# Altium project Main.PrjPcb
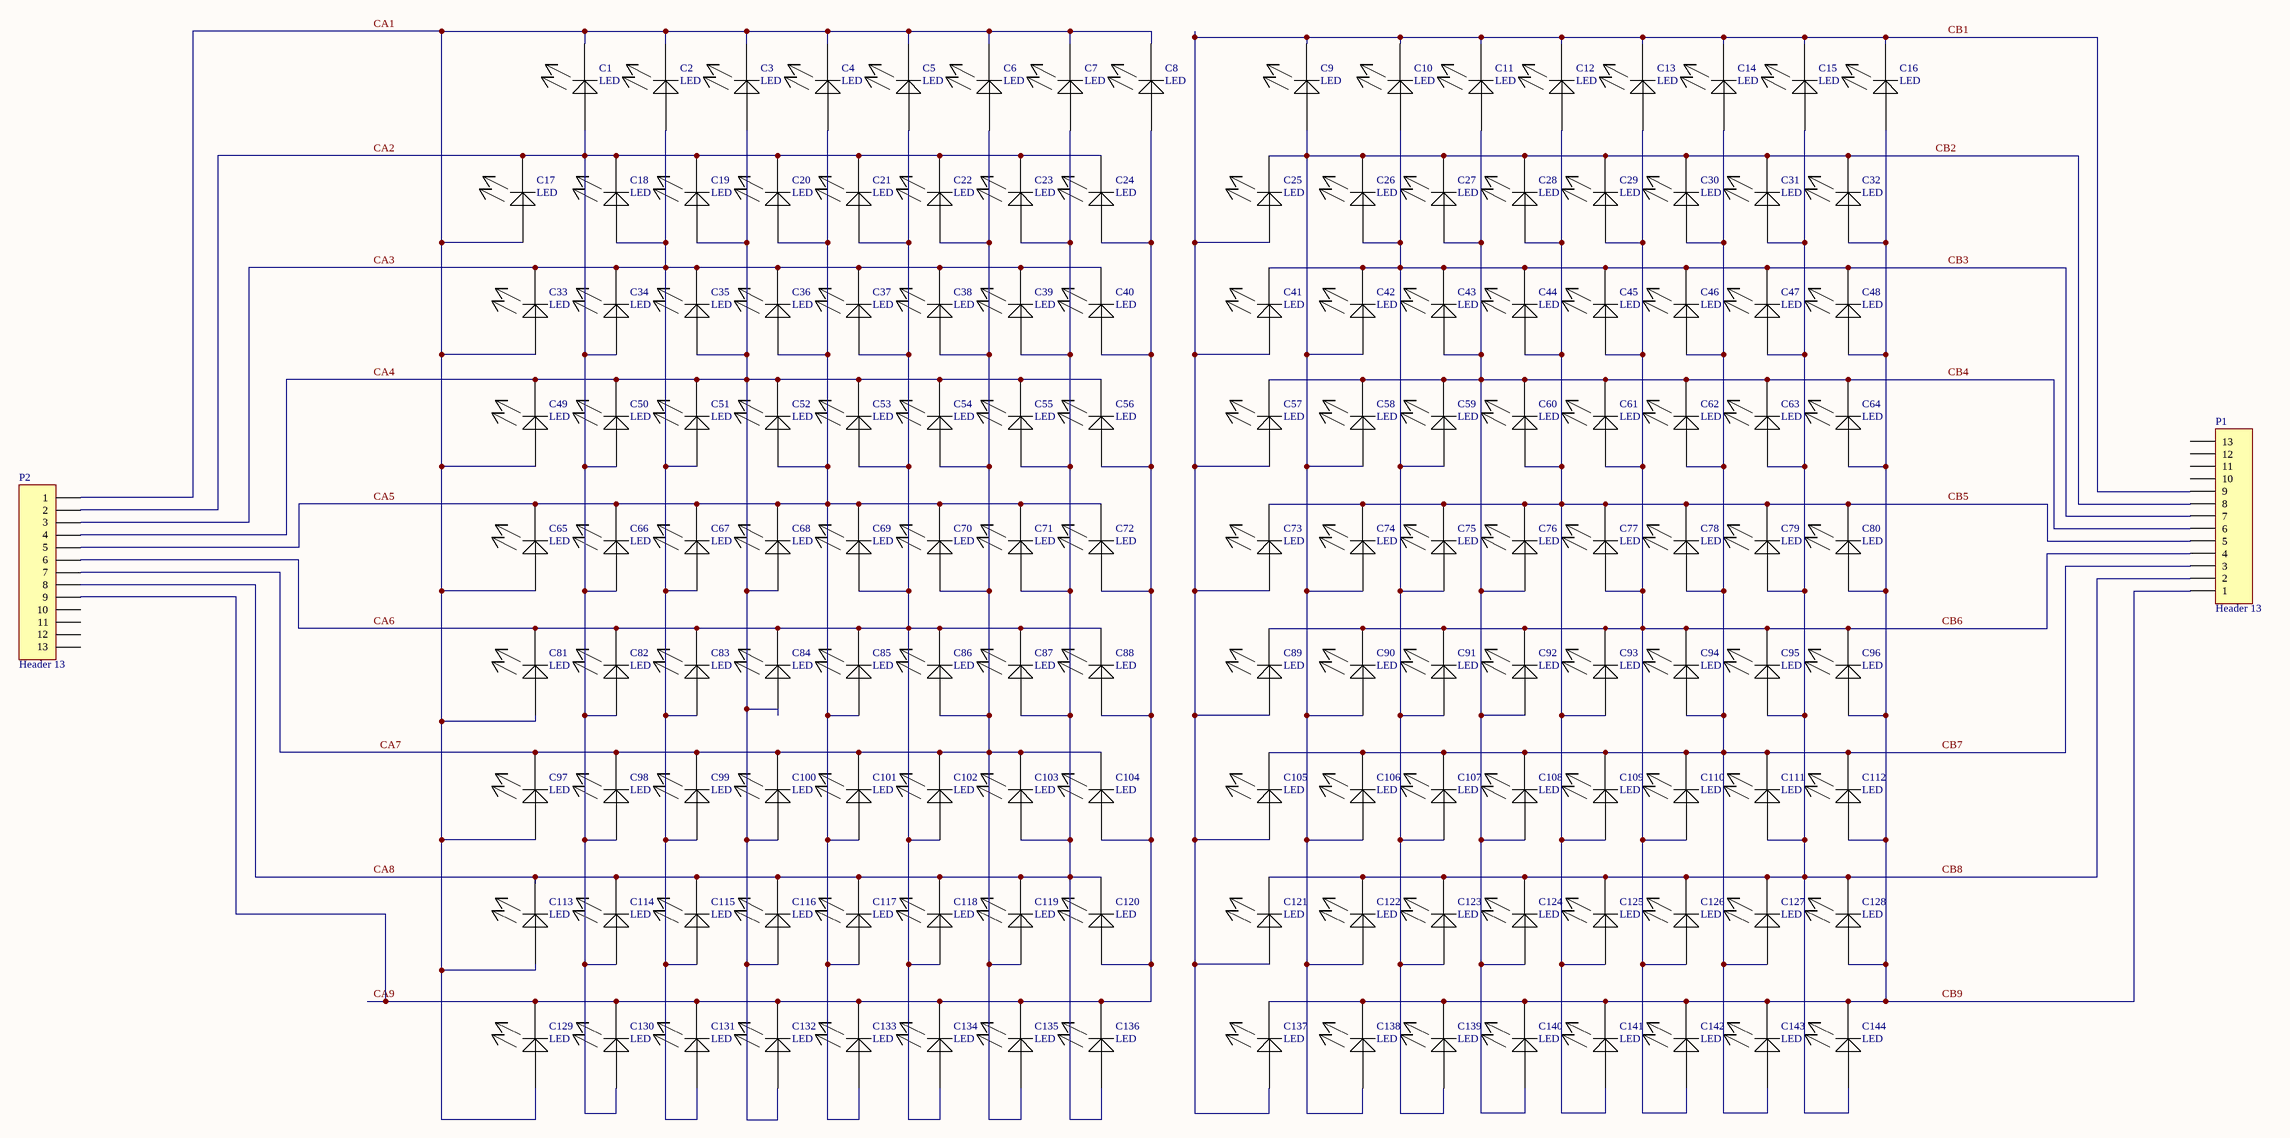
[diagram p0: Sheet1.SchDoc]
4 sheets, 601 parts. Net scope: flat (ports and power ports of the same name join across sheets).
Sheets:
  Sheet1.SchDoc
  Sheet2.SchDoc
  Sheet3.SchDoc
  Sheet4_Matrix.SchDoc

## Sheet Sheet1.SchDoc
size A1

### Parts
(Parts that share a designator on the sheet are numbered #1, #2 ... from top to bottom, then left to right.)
C1#1  LED  [LED 0603(2)]
C2#1  LED  [LED 0603(2)]
C3#1  LED  [LED 0603(2)]
C4#1  LED  [LED 0603(2)]
C5#1  LED  [LED 0603(2)]
C6#1  LED  [LED 0603(2)]
C7#1  LED  [LED 0603(2)]
C8#1  LED  [LED 0603(2)]
C9#1  LED  [LED 0603(2)]
C10#1  LED  [LED 0603(2)]
C11#1  LED  [LED 0603(2)]
C12#1  LED  [LED 0603(2)]
C13#1  LED  [LED 0603(2)]
C14#1  LED  [LED 0603(2)]
C15#1  LED  [LED 0603(2)]
C16#1  LED  [LED 0603(2)]
C17#1  LED  [LED 0603(2)]
C18#1  LED  [LED 0603(2)]
C19  LED  [LED 0603(2)]
C20  LED  [LED 0603(2)]
C21  LED  [LED 0603(2)]
C22  LED  [LED 0603(2)]
C23  LED  [LED 0603(2)]
C24  LED  [LED 0603(2)]
C25  LED  [LED 0603(2)]
C26  LED  [LED 0603(2)]
C27  LED  [LED 0603(2)]
C28  LED  [LED 0603(2)]
C29  LED  [LED 0603(2)]
C30  LED  [LED 0603(2)]
C31  LED  [LED 0603(2)]
C32  LED  [LED 0603(2)]
C33  LED  [LED 0603(2)]
C34  LED  [LED 0603(2)]
C35  LED  [LED 0603(2)]
C36  LED  [LED 0603(2)]
C37  LED  [LED 0603(2)]
C38  LED  [LED 0603(2)]
C39  LED  [LED 0603(2)]
C40  LED  [LED 0603(2)]
C41  LED  [LED 0603(2)]
C42  LED  [LED 0603(2)]
C43  LED  [LED 0603(2)]
C44  LED  [LED 0603(2)]
C45  LED  [LED 0603(2)]
C46  LED  [LED 0603(2)]
C47  LED  [LED 0603(2)]
C48  LED  [LED 0603(2)]
C49  LED  [LED 0603(2)]
C50  LED  [LED 0603(2)]
C51  LED  [LED 0603(2)]
C52  LED  [LED 0603(2)]
C53  LED  [LED 0603(2)]
C54  LED  [LED 0603(2)]
C55  LED  [LED 0603(2)]
C56  LED  [LED 0603(2)]
C57  LED  [LED 0603(2)]
C58  LED  [LED 0603(2)]
C59  LED  [LED 0603(2)]
C60  LED  [LED 0603(2)]
C61  LED  [LED 0603(2)]
C62  LED  [LED 0603(2)]
C63  LED  [LED 0603(2)]
C64  LED  [LED 0603(2)]
C65  LED  [LED 0603(2)]
C66  LED  [LED 0603(2)]
C67  LED  [LED 0603(2)]
C68  LED  [LED 0603(2)]
C69  LED  [LED 0603(2)]
C70  LED  [LED 0603(2)]
C71  LED  [LED 0603(2)]
C72  LED  [LED 0603(2)]
C73  LED  [LED 0603(2)]
C74  LED  [LED 0603(2)]
C75  LED  [LED 0603(2)]
C76  LED  [LED 0603(2)]
C77  LED  [LED 0603(2)]
C78  LED  [LED 0603(2)]
C79  LED  [LED 0603(2)]
C80  LED  [LED 0603(2)]
C81  LED  [LED 0603(2)]
C82  LED  [LED 0603(2)]
C83  LED  [LED 0603(2)]
C84  LED  [LED 0603(2)]
C85  LED  [LED 0603(2)]
C86  LED  [LED 0603(2)]
C87  LED  [LED 0603(2)]
C88  LED  [LED 0603(2)]
C89  LED  [LED 0603(2)]
C90  LED  [LED 0603(2)]
C91  LED  [LED 0603(2)]
C92  LED  [LED 0603(2)]
C93  LED  [LED 0603(2)]
C94  LED  [LED 0603(2)]
C95  LED  [LED 0603(2)]
C96  LED  [LED 0603(2)]
C97  LED  [LED 0603(2)]
C98  LED  [LED 0603(2)]
C99  LED  [LED 0603(2)]
C100  LED  [LED 0603(2)]
C101  LED  [LED 0603(2)]
C102  LED  [LED 0603(2)]
C103  LED  [LED 0603(2)]
C104  LED  [LED 0603(2)]
C105  LED  [LED 0603(2)]
C106  LED  [LED 0603(2)]
C107  LED  [LED 0603(2)]
C108  LED  [LED 0603(2)]
C109  LED  [LED 0603(2)]
C110  LED  [LED 0603(2)]
C111  LED  [LED 0603(2)]
C112  LED  [LED 0603(2)]
C113  LED  [LED 0603(2)]
C114  LED  [LED 0603(2)]
C115  LED  [LED 0603(2)]
C116  LED  [LED 0603(2)]
C117  LED  [LED 0603(2)]
C118  LED  [LED 0603(2)]
C119  LED  [LED 0603(2)]
C120  LED  [LED 0603(2)]
C121  LED  [LED 0603(2)]
C122  LED  [LED 0603(2)]
C123  LED  [LED 0603(2)]
C124  LED  [LED 0603(2)]
C125  LED  [LED 0603(2)]
C126  LED  [LED 0603(2)]
C127  LED  [LED 0603(2)]
C128  LED  [LED 0603(2)]
C129  LED  [LED 0603(2)]
C130  LED  [LED 0603(2)]
C131  LED  [LED 0603(2)]
C132  LED  [LED 0603(2)]
C133  LED  [LED 0603(2)]
C134  LED  [LED 0603(2)]
C135  LED  [LED 0603(2)]
C136  LED  [LED 0603(2)]
C137  LED  [LED 0603(2)]
C138  LED  [LED 0603(2)]
C139  LED  [LED 0603(2)]
C140  LED  [LED 0603(2)]
C141  LED  [LED 0603(2)]
C142  LED  [LED 0603(2)]
C143  LED  [LED 0603(2)]
C144  LED  [LED 0603(2)]
P1#1  Header 13  [HDR1X13]
P2#1  Header 13  [HDR1X13]

### Nets
CA1: C1#1.2(-) C2#1.2(-) C3#1.2(-) C4#1.2(-) C5#1.2(-) C6#1.2(-) C7#1.2(-) C8#1.2(-) C17#1.1(+) C33.1(+) C49.1(+) C65.1(+) C81.1(+) C97.1(+) C113.1(+) C129.1(+) P2#1.1
CA2: C1#1.1(+) C17#1.2(-) C18#1.2(-) C19.2(-) C20.2(-) C21.2(-) C22.2(-) C23.2(-) C24.2(-) C34.1(+) C50.1(+) C66.1(+) C82.1(+) C98.1(+) C114.1(+) C130.1(+) P2#1.2
CA3: C2#1.1(+) C18#1.1(+) C33.2(-) C34.2(-) C35.2(-) C36.2(-) C37.2(-) C38.2(-) C39.2(-) C40.2(-) C51.1(+) C67.1(+) C83.1(+) C99.1(+) C115.1(+) C131.1(+) P2#1.3
CA4: C3#1.1(+) C19.1(+) C35.1(+) C49.2(-) C50.2(-) C51.2(-) C52.2(-) C53.2(-) C54.2(-) C55.2(-) C56.2(-) C68.1(+) C84.1(+) C100.1(+) C116.1(+) C132.1(+) P2#1.4
CA5: C4#1.1(+) C20.1(+) C36.1(+) C52.1(+) C65.2(-) C66.2(-) C67.2(-) C68.2(-) C69.2(-) C70.2(-) C71.2(-) C72.2(-) C85.1(+) C101.1(+) C117.1(+) C133.1(+) P2#1.5
CA6: C5#1.1(+) C21.1(+) C37.1(+) C53.1(+) C69.1(+) C81.2(-) C82.2(-) C83.2(-) C84.2(-) C85.2(-) C86.2(-) C87.2(-) C88.2(-) C102.1(+) C118.1(+) C134.1(+) P2#1.6
CA7: C6#1.1(+) C22.1(+) C38.1(+) C54.1(+) C70.1(+) C86.1(+) C97.2(-) C98.2(-) C99.2(-) C100.2(-) C101.2(-) C102.2(-) C103.2(-) C104.2(-) C119.1(+) C135.1(+) P2#1.7
CA8: C7#1.1(+) C23.1(+) C39.1(+) C55.1(+) C71.1(+) C87.1(+) C103.1(+) C113.2(-) C114.2(-) C115.2(-) C116.2(-) C117.2(-) C118.2(-) C119.2(-) C120.2(-) C136.1(+) P2#1.8
CA9: C8#1.1(+) C24.1(+) C40.1(+) C56.1(+) C72.1(+) C88.1(+) C104.1(+) C120.1(+) C129.2(-) C130.2(-) C131.2(-) C132.2(-) C133.2(-) C134.2(-) C135.2(-) C136.2(-) P2#1.9
CB1: C9#1.2(-) C10#1.2(-) C11#1.2(-) C12#1.2(-) C13#1.2(-) C14#1.2(-) C15#1.2(-) C16#1.2(-) C25.1(+) C41.1(+) C57.1(+) C73.1(+) C89.1(+) C105.1(+) C121.1(+) C137.1(+) P1#1.9
CB2: C9#1.1(+) C25.2(-) C26.2(-) C27.2(-) C28.2(-) C29.2(-) C30.2(-) C31.2(-) C32.2(-) C42.1(+) C58.1(+) C74.1(+) C90.1(+) C106.1(+) C122.1(+) C138.1(+) P1#1.8
CB3: C10#1.1(+) C26.1(+) C41.2(-) C42.2(-) C43.2(-) C44.2(-) C45.2(-) C46.2(-) C47.2(-) C48.2(-) C59.1(+) C75.1(+) C91.1(+) C107.1(+) C123.1(+) C139.1(+) P1#1.7
CB4: C11#1.1(+) C27.1(+) C43.1(+) C57.2(-) C58.2(-) C59.2(-) C60.2(-) C61.2(-) C62.2(-) C63.2(-) C64.2(-) C76.1(+) C92.1(+) C108.1(+) C124.1(+) C140.1(+) P1#1.6
CB5: C12#1.1(+) C28.1(+) C44.1(+) C60.1(+) C73.2(-) C74.2(-) C75.2(-) C76.2(-) C77.2(-) C78.2(-) C79.2(-) C80.2(-) C93.1(+) C109.1(+) C125.1(+) C141.1(+) P1#1.5
CB6: C13#1.1(+) C29.1(+) C45.1(+) C61.1(+) C77.1(+) C89.2(-) C90.2(-) C91.2(-) C92.2(-) C93.2(-) C94.2(-) C95.2(-) C96.2(-) C110.1(+) C126.1(+) C142.1(+) P1#1.4
CB7: C14#1.1(+) C30.1(+) C46.1(+) C62.1(+) C78.1(+) C94.1(+) C105.2(-) C106.2(-) C107.2(-) C108.2(-) C109.2(-) C110.2(-) C111.2(-) C112.2(-) C127.1(+) C143.1(+) P1#1.3
CB8: C15#1.1(+) C31.1(+) C47.1(+) C63.1(+) C79.1(+) C95.1(+) C111.1(+) C121.2(-) C122.2(-) C123.2(-) C124.2(-) C125.2(-) C126.2(-) C127.2(-) C128.2(-) C144.1(+) P1#1.2
CB9: C16#1.1(+) C32.1(+) C48.1(+) C64.1(+) C80.1(+) C96.1(+) C112.1(+) C128.1(+) C137.2(-) C138.2(-) C139.2(-) C140.2(-) C141.2(-) C142.2(-) C143.2(-) C144.2(-) P1#1.1

Not connected (* = marked no-connect by the designer): P1#1 10 11 12 13; P2#1 10 11 12 13

### Library data of the parts
P1#1 P2#1 = Header 13: Header, 13-Pin; LatestRevisionDate: 17-Jul-2002; LatestRevisionNote: Re-released for DXP Platform.; Publisher: Altium Limited

## Sheet Sheet2.SchDoc
size A3
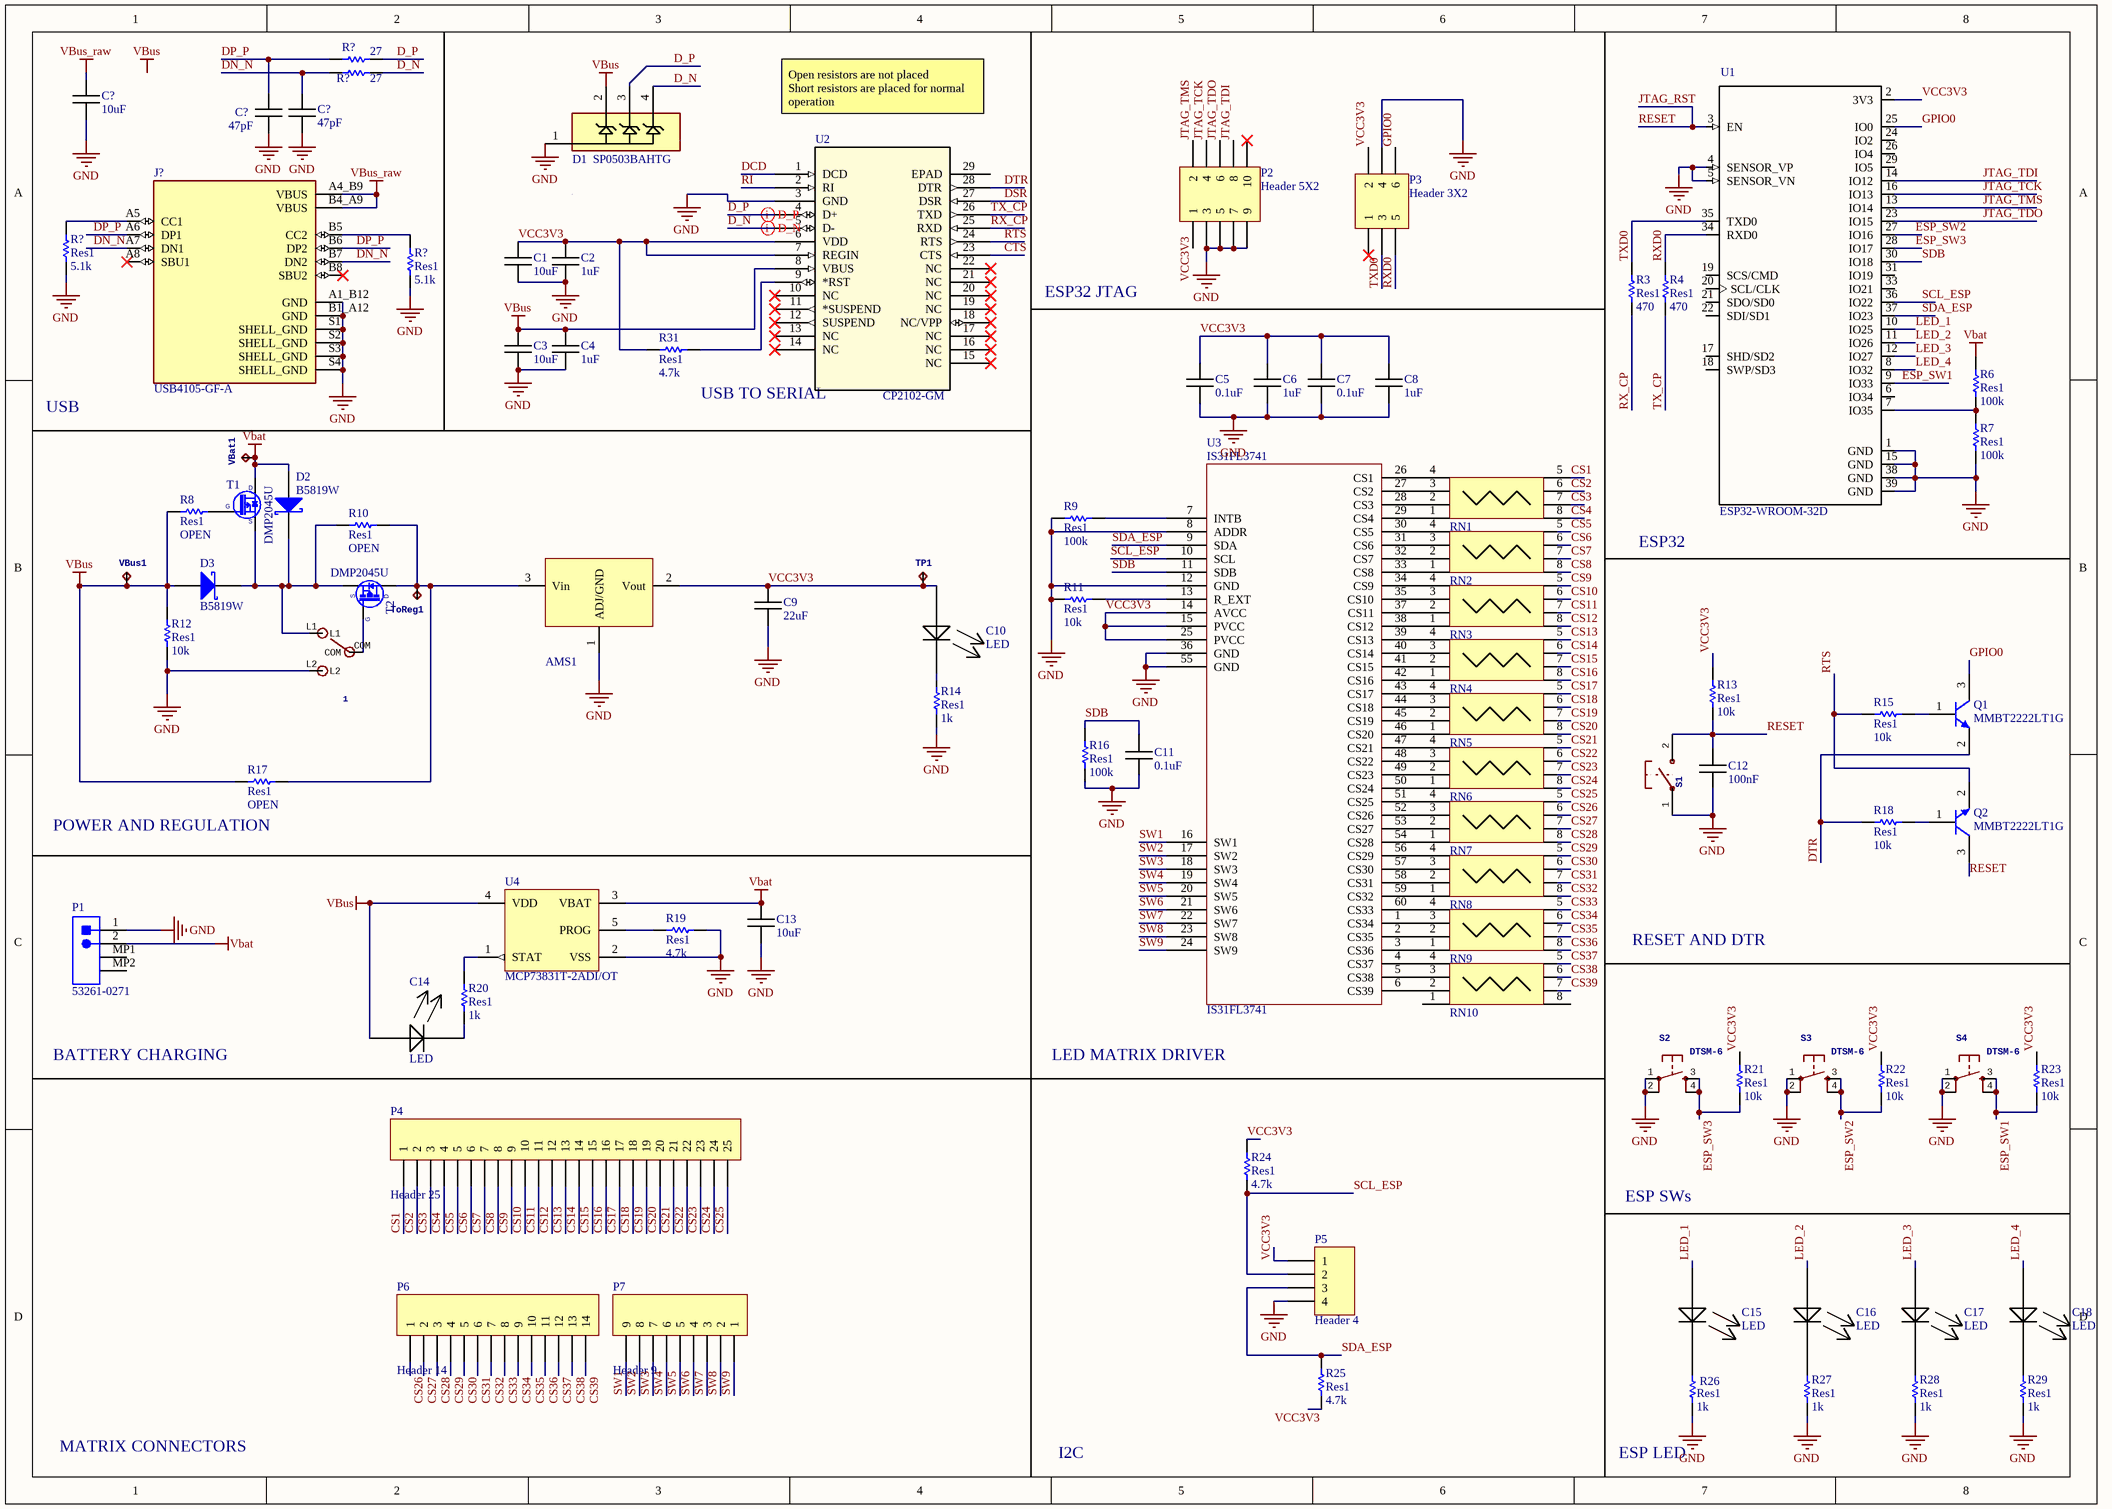
[diagram p1: Sheet2.SchDoc]

### Parts
(Parts that share a designator on the sheet are numbered #1, #2 ... from top to bottom, then left to right.)
1  Footprint of the VIMEX MSK-12C02 SPDT SMD Switch Created by mzst on 17-Jan-2016  [MSK-12C02]  (value not drawn)
AMS1  AMS1117  [SOT-223-3]  (value not drawn)
C1#2  10uF  [C 0603 / 1608]
C2#2  1uF  [C 0603 / 1608]
C3#2  10uF  [C 0603 / 1608]
C4#2  1uF  [C 0603 / 1608]
C5#2  0.1uF  [C 0603 / 1608]
C6#2  1uF  [C 0603 / 1608]
C7#2  0.1uF  [C 0603 / 1608]
C8#2  1uF  [C 0603 / 1608]
C9#2  22uF  [C 0603 / 1608]
C10#2  LED  [LED 0603(2)]
C11#2  0.1uF  [C 0603 / 1608]
C12#2  100nF  [C 0603 / 1608]
C13#2  10uF  [C 0603 / 1608]
C14#2  LED  [LED 0603(2)]
C15#2  LED  [LED 0603(2)]
C16#2  LED  [LED 0603(2)]
C17#2  LED  [LED 0603(2)]
C18#2  LED  [LED 0603(2)]
C?#1  10uF  [C 0603 / 1608]
C?#2  47pF  [C 0603 / 1608]
C?#3  47pF  [C 0603 / 1608]
D1  Part Number: SP0503BAHTG  [Littelfuse_SP0503BAHTG_0]  (hidden comment: Diode_Littelfuse_SP0503BAHTG_eec)
D2  B5819W  [MCC-SOD123_V]
D3  B5819W  [MCC-SOD123_V]
J?  USB4105-GF-A  [GCT_USB4105-GF-A]
P1#2  53261-0271  [MOLX-53261-0271_V]
P2#2  Header 5X2  [5x2_SidePCB]
P3  Header 3X2  [3x2_SidePCB]
P4  Header 25  [HDR1X25]
P5  Header 4  [HDR1X4]
P6  Header 14  [HDR1X14]
P7  Header 9  [HDR1X9]
Q1  MMBT2222LT1G  [ONSC-SOT-23-3-318-08_M]
Q2  MMBT2222LT1G  [ONSC-SOT-23-3-318-08_M]
R3  Res1  value 470  [C 0603 / 1608]
R4  Res1  value 470  [C 0603 / 1608]
R6  Res1  value 100k  [C 0603 / 1608]
R7  Res1  value 100k  [C 0603 / 1608]
R8  Res1  value OPEN  [C 0603 / 1608]
R9  Res1  value 100k  [C 0603 / 1608]
R10  Res1  value OPEN  [C 0603 / 1608]
R11  Res1  value 10k  [C 0603 / 1608]
R12#1  Res1  value 10k  [C 0603 / 1608]
R13  Res1  value 10k  [C 0603 / 1608]
R14  Res1  value 1k  [C 0603 / 1608]
R15  Res1  value 10k  [C 0603 / 1608]
R16  Res1  value 100k  [C 0603 / 1608]
R17  Res1  value OPEN  [C 0603 / 1608]
R18  Res1  value 10k  [C 0603 / 1608]
R19  Res1  value 4.7k  [C 0603 / 1608]
R20  Res1  value 1k  [C 0603 / 1608]
R21  Res1  value 10k  [C 0603 / 1608]
R22  Res1  value 10k  [C 0603 / 1608]
R23  Res1  value 10k  [C 0603 / 1608]
R24  Res1  value 4.7k  [C 0603 / 1608]
R25  Res1  value 4.7k  [C 0603 / 1608]
R26  Res1  value 1k  [C 0603 / 1608]
R27  Res1  value 1k  [C 0603 / 1608]
R28  Res1  value 1k  [C 0603 / 1608]
R29  Res1  value 1k  [C 0603 / 1608]
R31  Res1  value 4.7k  [C 0603 / 1608]
R?#1  value 27  [C 0603 / 1608]  (hidden comment: Res1)
R?#2  value 27  [C 0603 / 1608]  (hidden comment: Res1)
R?#3  Res1  value 5.1k  [C 0603 / 1608]
R?#4  Res1  value 5.1k  [C 0603 / 1608]
RN1  742C083121JP  [RESARRAY(4x0603)]  (value not drawn)
RN2  742C083121JP  [RESARRAY(4x0603)]  (value not drawn)
RN3  742C083121JP  [RESARRAY(4x0603)]  (value not drawn)
RN4  742C083121JP  [RESARRAY(4x0603)]  (value not drawn)
RN5  742C083121JP  [RESARRAY(4x0603)]  (value not drawn)
RN6  742C083121JP  [RESARRAY(4x0603)]  (value not drawn)
RN7  742C083121JP  [RESARRAY(4x0603)]  (value not drawn)
RN8  742C083121JP  [RESARRAY(4x0603)]  (value not drawn)
RN9  742C083121JP  [RESARRAY(4x0603)]  (value not drawn)
RN10  742C083121JP  [RESARRAY(4x0603)]  (value not drawn)
S1  Switch  [PUSH_SMD_3x4]  (value not drawn)
S2  DTSM-6  [DTSM-6]
S3  DTSM-6  [DTSM-6]
S4  DTSM-6  [DTSM-6]
T1  DMP2045U  [SOT95P237X112-3N]
T2  DMP2045U  [SOT95P237X112-3N]
ToReg1  Test pad  [TP20R]  (value not drawn)
TP1  Test pad  [TP20R]  (value not drawn)
U1  ESP32-WROOM-32D  [MODULE_ESP32-WROOM-32D]
U2  CP2102-GM  [QFN28_5X5]
U3#1  IS31FL3741  [QFN40P700X700X80-61N]
U4  MCP73831T-2ADI/OT  [SOT-23-OT5_M]
VBat1  Test pad  [TP20R]  (value not drawn)
VBus1  Test pad  [TP20R]  (value not drawn)

### Nets
GND: 1.L2 AMS1.1(ADJ/GND) C1#2.1 C2#2.1 C3#2.1 C4#2.1 C5#2.1 C6#2.1 C7#2.1 C8#2.1 C9#2.1 C11#2.2 C12#2.2 C13#2.1 C?#1.1 C?#2.1 C?#3.1 D1.1(COMMON_ANODE) J?.A1_B12(GND) J?.B1_A12(GND) J?.S1(SHELL_GND) J?.S2(SHELL_GND) J?.S3(SHELL_GND) J?.S4(SHELL_GND) P1#2.1 P2#2.3 P2#2.5 P2#2.7 P2#2.9 P3.4 P5.4 R7.1 R9.1 R11.1 R12#1.2 R14.2 R16.1 R19.1 R26.2 R27.2 R28.2 R29.2 R?#3.1 R?#4.1 S1.1(P$1) S2.1 S2.2 S3.1 S3.2 S4.1 S4.2 U1.1(GND) U1.4(SENSOR_VP) U1.5(SENSOR_VN) U1.15(GND) U1.38(GND) U1.39(GND) U2.3(GND) U3#1.8(ADDR) U3#1.12(GND) U3#1.36(GND) U3#1.55(GND) U4.2(VSS)
Vbat: C13#2.2 D2.1(A) P1#2.2 R6.2 T1.3(D) U4.3(VBAT) VBat1.TP
VBus: C3#2.2 C4#2.2 C14#2.1(+) D1.2(1_CATHODE) D3.1(A) R8.1 R12#1.1 R17.1 U2.8(VBUS) U4.4(VDD) VBus1.TP
VBus_raw: C?#1.2 J?.A4_B9(VBUS) J?.B4_A9(VBUS)
CS1: P4.1 RN1.5
CS2: P4.2 RN1.6
CS3: P4.3 RN1.7
CS4: P4.4 RN1.8
CS5: P4.5 RN2.5
CS6: P4.6 RN2.6
CS7: P4.7 RN2.7
CS8: P4.8 RN2.8
CS9: P4.9 RN3.5
CS10: P4.10 RN3.6
CS11: P4.11 RN3.7
CS12: P4.12 RN3.8
CS13: P4.13 RN4.5
CS14: P4.14 RN4.6
CS15: P4.15 RN4.7
CS16: P4.16 RN4.8
CS17: P4.17 RN5.5
CS18: P4.18 RN5.6
CS19: P4.19 RN5.7
CS20: P4.20 RN5.8
CS21: P4.21 RN6.5
CS22: P4.22 RN6.6
CS23: P4.23 RN6.7
CS24: P4.24 RN6.8
CS25: P4.25 RN7.5
CS26: P6.1 RN7.6
CS27: P6.2 RN7.7
CS28: P6.3 RN7.8
CS29: P6.4 RN8.5
CS30: P6.5 RN8.6
CS31: P6.6 RN8.7
CS32: P6.7 RN8.8
CS33: P6.8 RN9.5
CS34: P6.9 RN9.6
CS35: P6.10 RN9.7
CS36: P6.11 RN9.8
CS37: P6.12 RN10.5
CS38: P6.13 RN10.6
CS39: P6.14 RN10.7
CTS: U2.23(CTS)
D_N: D1.4(3_CATHODE) R?#2.1 U2.5(D-)
D_P: D1.3(2_CATHODE) R?#1.1 U2.4(D+)
DCD: U2.1(DCD)
DN_N: C?#3.2 J?.A7(DN1) J?.B7(DN2) R?#2.2
DP_P: C?#2.2 J?.A6(DP1) J?.B6(DP2) R?#1.2
DSR: U2.27(DSR)
DTR: Q1.2(E) R18.1 U2.28(DTR)
ESP_SW1: R23.1 S4.3 S4.4 U1.9(IO33)
ESP_SW2: R22.1 S3.3 S3.4 U1.27(IO16)
ESP_SW3: R21.1 S2.3 S2.4 U1.28(IO17)
GPIO0: P3.6 Q1.3(C) U1.25(IO0)
JTAG_RST: C12#2.1 Q2.3(C) R13.2 S1.2(P$2) U1.3(EN)  [also labelled RESET]
JTAG_TCK: P2#2.4 U1.16(IO13)
JTAG_TDI: P2#2.8 U1.14(IO12)
JTAG_TDO: P2#2.6 U1.23(IO15)
JTAG_TMS: P2#2.2 U1.13(IO14)
LED_1: C15#2.1(+) U1.10(IO25)
LED_2: C16#2.1(+) U1.11(IO26)
LED_3: C17#2.1(+) U1.12(IO27)
LED_4: C18#2.1(+) U1.8(IO32)
RI: U2.2(RI)
RTS: Q2.2(E) R15.1 U2.24(RTS)
RX_CP: R3.1 U2.25(RXD)
RXD0: P3.5 R4.2 U1.34(RXD0)
SCL_ESP: P5.2 R24.2 U1.36(IO22) U3#1.10(SCL)
SDA_ESP: P5.3 R25.2 U1.37(IO23) U3#1.9(SDA)
SDB: C11#2.1 R16.2 U1.30(IO18) U3#1.11(SDB)
SW1: P7.9 U3#1.16(SW1)
SW2: P7.8 U3#1.17(SW2)
SW3: P7.7 U3#1.18(SW3)
SW4: P7.6 U3#1.19(SW4)
SW5: P7.5 U3#1.20(SW5)
SW6: P7.4 U3#1.21(SW6)
SW7: P7.3 U3#1.22(SW7)
SW8: P7.2 U3#1.23(SW8)
SW9: P7.1 U3#1.24(SW9)
TX_CP: R4.1 U2.26(TXD)
TXD0: P3.3 R3.2 U1.35(TXD0)
VCC3V3: AMS1.2(Vout) C1#2.2 C2#2.2 C5#2.2 C6#2.2 C7#2.2 C8#2.2 C9#2.2 C10#2.1(+) P3.2 P5.1 R13.1 R21.2 R22.2 R23.2 R24.1 R25.1 R31.1 TP1.TP U1.2(3V3) U2.6(VDD) U2.7(REGIN) U3#1.14(AVCC) U3#1.15(PVCC) U3#1.25(PVCC)
Net1_COM: 1.COM T2.1(G)
Net1_L1: 1.L1 D2.2(K) D3.2(K) R10.1 T1.2(S) T2.2(S)
NetAMS1_3: AMS1.3(Vin) R10.2 R17.2 T2.3(D) ToReg1.TP
NetC10#2_2: C10#2.2(-) R14.1
NetC14#2_2: C14#2.2(-) R20.2
NetC15#2_2: C15#2.2(-) R26.1
NetC16#2_2: C16#2.2(-) R27.1
NetC17#2_2: C17#2.2(-) R28.1
NetC18#2_2: C18#2.2(-) R29.1
NetJ?_A5: J?.A5(CC1) R?#3.2
NetJ?_B5: J?.B5(CC2) R?#4.2
NetQ1_1: Q1.1(B) R15.2
NetQ2_1: Q2.1(B) R18.2
NetR6_1: R6.1 R7.2 U1.7(IO35)
NetR8_2: R8.2 T1.1(G)
NetR9_2: R9.2 U3#1.7(INTB)
NetR11_2: R11.2 U3#1.13(R_EXT)
NetR19_2: R19.2 U4.5(PROG)
NetR20_1: R20.1 U4.1(STAT)
NetR31_2: R31.2 U2.9(*RST)
NetRN1_1: RN1.1 U3#1.29(CS4)
NetRN1_2: RN1.2 U3#1.28(CS3)
NetRN1_3: RN1.3 U3#1.27(CS2)
NetRN1_4: RN1.4 U3#1.26(CS1)
NetRN2_1: RN2.1 U3#1.33(CS8)
NetRN2_2: RN2.2 U3#1.32(CS7)
NetRN2_3: RN2.3 U3#1.31(CS6)
NetRN2_4: RN2.4 U3#1.30(CS5)
NetRN3_1: RN3.1 U3#1.38(CS12)
NetRN3_2: RN3.2 U3#1.37(CS11)
NetRN3_3: RN3.3 U3#1.35(CS10)
NetRN3_4: RN3.4 U3#1.34(CS9)
NetRN4_1: RN4.1 U3#1.42(CS16)
NetRN4_2: RN4.2 U3#1.41(CS15)
NetRN4_3: RN4.3 U3#1.40(CS14)
NetRN4_4: RN4.4 U3#1.39(CS13)
NetRN5_1: RN5.1 U3#1.46(CS20)
NetRN5_2: RN5.2 U3#1.45(CS19)
NetRN5_3: RN5.3 U3#1.44(CS18)
NetRN5_4: RN5.4 U3#1.43(CS17)
NetRN6_1: RN6.1 U3#1.50(CS24)
NetRN6_2: RN6.2 U3#1.49(CS23)
NetRN6_3: RN6.3 U3#1.48(CS22)
NetRN6_4: RN6.4 U3#1.47(CS21)
NetRN7_1: RN7.1 U3#1.54(CS28)
NetRN7_2: RN7.2 U3#1.53(CS27)
NetRN7_3: RN7.3 U3#1.52(CS26)
NetRN7_4: RN7.4 U3#1.51(CS25)
NetRN8_1: RN8.1 U3#1.59(CS32)
NetRN8_2: RN8.2 U3#1.58(CS31)
NetRN8_3: RN8.3 U3#1.57(CS30)
NetRN8_4: RN8.4 U3#1.56(CS29)
NetRN9_1: RN9.1 U3#1.3(CS36)
NetRN9_2: RN9.2 U3#1.2(CS35)
NetRN9_3: RN9.3 U3#1.1(CS34)
NetRN9_4: RN9.4 U3#1.60(CS33)
NetRN10_2: RN10.2 U3#1.6(CS39)
NetRN10_3: RN10.3 U3#1.5(CS38)
NetRN10_4: RN10.4 U3#1.4(CS37)

Not connected (* = marked no-connect by the designer): J? A8(SBU1)* B8(SBU2)*; P1#2 MP1 MP2; P2#2 1 10*; P3 1*; RN10 1 8; U1 6(IO34) 17(SHD/SD2) 18(SWP/SD3) 19(SCS/CMD) 20(SCL/CLK) 21(SDO/SD0) 22(SDI/SD1) 24(IO2) 26(IO4) 29(IO5) 31(IO19) 33(IO21); U2 10(NC)* 11(*SUSPEND)* 12(SUSPEND)* 13(NC)* 14(NC)* 15(NC)* 16(NC)* 17(NC)* 18(NC/VPP)* 19(NC)* 20(NC)* 21(NC)* 22(NC)* 29(EPAD)

### Layout directives
differential pair: D_N, D_P

### Notes on the sheet
- Open resistors are not placed
  Short resistors are placed for normal operation
- ESP32 JTAG
- USB
- (near U2) USB TO SERIAL
- ESP32
- (near R17) POWER AND REGULATION
- RESET AND DTR
- BATTERY CHARGING
- LED MATRIX DRIVER
- ESP SWs
- MATRIX CONNECTORS
- I2C
- (near R26) ESP LED
- Labels drawn without touching a wire or pin: VBus, VCC3V3

### Library data of the parts
1 = MSK-12C02_SMD_SPDT_SWITCH
AMS1 = AMS1117: LDO 3.3V/5V/12V
C1#2 C2#2 C3#2 C4#2 C5#2 C6#2 C7#2 C8#2 C9#2 C11#2 C12#2 C13#2 C?#1-C?#3 = Capacitor
D1 = Diode_Littelfuse_SP0503BAHTG_eec: DIODE TVS DIODE 5.5VWM 8.5VC SOT143; helpURL: https://upverter.com/upn/revision/6b5b591e3bf31c16/; ComponentLink2Description: Datasheet; Temperature: -40°C to +85°C; Package: SOT143-4; Supplier 2: Mouser; Price: 0.571399033067; Supplier 1: Digi-Key; ComponentLink1URL: https://upverter.com/upn/revision/6b5b591e3bf31c16/; Supplier Part Number 2: 576-SP0503BAHTG; Supplier Part Number 1: F2715CT-ND; Manufacturer: Littelfuse; ComponentLink1Description: Upverter; ComponentLink2URL: http://www.littelfuse.com/~/media/electronics/datasheets/tvs_diode_arrays/littelfuse_tvs_diode_array_sp05_datasheet.pdf.pdf; RoHS: TRUE; Mouser Part Number: 576-SP0503BAHTG; Temperature Range High: +85°C; Digikey Description: DIODE TVS DIODE 5.5VWM 8.5VC SOT143; Digikey Part Number: F2715CT-ND; Lead Free: yes; Temperature Range Low: -40°C
D2 D3 = CMP-2100-03587-1: Schottky Barrier Rectifier, 1 A, 40 Vrm, -65 to 125 degC, 2-Pin SOD123, RoHS, Tape and Reel; Manufacturer: Micro Commercial Components; Package Description: 2-Pin Small Outline Diode, Body 2.7 x 1.6 mm, Height 1.35 mm; Datasheet URL: http://www.mccsemi.com/up_pdf/B5817W-B5819W(SOD-123).pdf; Manufacturer URL: http://www.mccsemi.com/; Package Reference: SOD123; Package URL: http://www.mccsemi.com/up_pdf/1N4448W(SOD-123).pdf; Datasheet Version: Rev. B, 01/2013
J? = USB4105-GF-A: USB-C (USB TYPE-C) USB 2.0 Receptacle Connector 24 (16+8 Dummy) Position Surface Mount, Right Angle; Through Hole; MF: GCT; Price: None; Value: *; MP: USB4105-GF-A; Package: None; Purchase-URL: https://pricing.snapeda.com/search/part/USB4105-GF-A/?ref=eda; SnapEDA_Link: https://www.snapeda.com/parts/USB4105-GF-A/Global%20Connector%20Technology/view-part/4423780/?ref=snap; Check_prices: https://www.snapeda.com/parts/USB4105-GF-A/Global%20Connector%20Technology/view-part/4423780/?ref=eda; Availability: Warning
P1#2 = CMP-2000-05633-1: PicoBlade(TM) Header, Right Angle, -40 to 85 degC, 2-Pin SMD, RoHS, Tape and Reel; Current - Max: 1A; Brand: Molex; Voltage Rating: 125V; Number of Positions: 2; Pitch: 1.25mm; Package Version: Rev. H, 11/2014; Factory Pack Quantity: 1000; Datasheet URL: http://www.molex.com/webdocs/datasheets/pdf/en-us/0532610271_PCB_HEADERS.pdf; Datasheet Version: 03/2016; Housing Material: Thermoplastic; RoHS: Details; Product Type: Headers; Number of Rows: 1; Termination Style: SMD; Mounting Technology: SurfaceMount; Number of Positions / Contacts: 2; Package URL: http://www.molex.com/pdm_docs/sd/532610271_sd.pdf; Mounting Angle: Right; Mounting Style: SMD/SMT; Manufacturer: Molex; Product Category: 1.25mmConnectors; Tradename: PicoBlade; Voltage - Max: 125V; Manufacturer URL: http://www.molex.com/; Series: 53261; Package Description: 2-Leads Header, Pitch 1.25 mm, Mated Height 3.4 mm; Package Reference: 53261-0271; Current Rating: 1A; Contact Plating: Tin; Contact Material: PhosphorBronze; Type: Shrouded; Packaging: Reel
P2#2 = Header 5X2: Header, 5-Pin, Dual row; LatestRevisionDate: 17-Jul-2002; LatestRevisionNote: Re-released for DXP Platform.; Publisher: Altium Limited
P3 = Header 3X2: Header, 3-Pin, Dual row; LatestRevisionDate: 17-Jul-2002; LatestRevisionNote: Re-released for DXP Platform.; Publisher: Altium Limited
P4 = Header 25: Header, 25-Pin; LatestRevisionDate: 17-Jul-2002; LatestRevisionNote: Re-released for DXP Platform.; Publisher: Altium Limited
P5 = Header 4: Header, 4-Pin; LatestRevisionDate: 17-Jul-2002; LatestRevisionNote: Re-released for DXP Platform.; Publisher: Altium Limited
P6 = Header 14: Header, 14-Pin; LatestRevisionDate: 17-Jul-2002; LatestRevisionNote: Re-released for DXP Platform.; Publisher: Altium Limited
P7 = Header 9: Header, 9-Pin; LatestRevisionDate: 17-Jul-2002; LatestRevisionNote: Re-released for DXP Platform.; Publisher: Altium Limited
Q1 Q2 = CMP-0722-00001-1: General Purpose Transistor, NPN, 0.6 A IC Continuous, 3-Pin SOT23, RoHS, Tape and Reel; Manufacturer: ON Semiconductor; PTM Max.: 0.225 W; HFE Max.: 300; HFE Min.: 100; V(BR) CEO: 30 V Min.; FT: 250 MHz; IC Continuous: 0.6 A; RoHS: TRUE; DatasheetVersion: Rev. 10; PackageVersion: Rev. AP; Polarity: NPN; PackageReference: SOT-23-3; PackageDescription: 3-Pin SOT23, Body 2.9 x 1.3 mm, Pitch 0.95 mm; ComponentLink1URL: http://www.onsemi.com/; ComponentLink2URL: http://www.onsemi.com/pub_link/Collateral/MMBT2222LT1-D.PDF; PartNumber: MMBT2222LT1G; ComponentLink3URL: http://www.onsemi.com/pub_link/Collateral/MMBT2222LT1-D.PDF; Mounting Technology: Surface Mount; ComponentLink3Description: Package Specification; ComponentLink1Description: Manufacturer URL; Packing: Tape and Reel; ComponentLink2Description: Datasheet
R3 R4 R6-R11 R12#1 R13-R29 R31 R?#1-R?#4 = Res1: Resistor; Published: 8-Jun-2000; LatestRevisionDate: 17-Jul-2002; LatestRevisionNote: Re-released for DXP Platform.; PackageReference: AXIAL-0.3; Publisher: Altium Limited; PackageDescription: Axial Device, Thru-Hole; 2 Leads; 0.3 in Pin Spacing
RN1-RN10 = Resistor Array 4x: Res Thick Film Array 120 Ohm 5% 1/4W Â±200ppm/Â°C ISOL Molded 8-Pin 1206_4 X 0603_ Concave SMD Paper T/R; MF: CTS Resistor; Availability: Unavailable; SnapEDA_Link: https://www.snapeda.com/parts/742C083121JP/CTS%20Resistor%20Products/view-part/?ref=snap; Price: None; Package: 1206 CTS Components; MP: 742C083121JP; Value: *
S1 = B3U-1000P: MANUFACTURER: Omron; DIGIKEY: SW1020CT-ND; MPN: B3U-1000P
T1 T2 = Si2333CDS-T1-GE3: P-CHANNEL MOSFET WITH DIODE; Part Description: -12V -5.1A P-Channel  TrenchFET® Power MOSFET; Manufacturer: VISHAY SILICONIX; PressFit: No; Bonding: No; Part Number: Si2333CDS-T1-GE3; Component Kind: Standard; Component Type: Standard; Device: Si2333CDS-T1-GE3; PackageDescription: SOT, 0.95mm, pitch; 3 pin,1.30mm W X 2.92mm L X 1.12mm H body, IPC Medium Density; Manufacturer Part Number: Si2333CDS-T1-GE3; Pin Count: 3; Case: SOT23-3; Mounted: Yes; Socket: No; SMD: Yes; Sense: No; ComponentHeight: 1.12mm; HelpURL: \\cern.ch\dfs\Applications\Altium\Datasheets\Si2333CDS-T1-GE3.pdf; Author: CERN DEM JLC; CreateDate: 03/03/2011; LatestRevisionDate: 02/05/2011
ToReg1 TP1 VBat1 VBus1 = TPTP20R
U1 = ESP32-WROOM-32D: IC: SoC; GPIO, I2C, I2S, IR, SD, SDIO, SPI, UART; 2.7Ã·3.6VDC; 20dBm; MF: Espressif Systems; Availability: Warning; SnapEDA_Link: https://www.snapeda.com/parts/ESP32-WROOM-32D/Espressif%20Systems/view-part/?ref=snap; MP: ESP32-WROOM-32D; Price: 3.98 USD; Package: Module Espressif Systems; Value: *
U2 = CP2102-GM: No Description Available; Vendor: Silicon Labs; Built_By: EMA_UL_Team; Manufacturer_Part_Number: CP2102-GM; Copyright: Copyright (C) 2018 Accelerated Designs. All rights reserved; RefDes: RefDes; Type: DEV; Value: Value
U4 = CMP-0133-00142-1: Miniature Single-Cell, Fully Integrated Li-Ion, Li-Polymer Charge Management Controller, 4.2V, 5-Pin SOT-23, Industrial Temperature, Tape and Reel; PackageVersion: revBB, Aug-2009; DatasheetVersion: revE, Sep-2008; PackageDescription: 5-Lead Plastic Small Outline Transistor (OT) [SOT-23]; PackageReference: SOT-23-OT5; Code_IPC: SOT23-5

## Sheet Sheet3.SchDoc
size A4
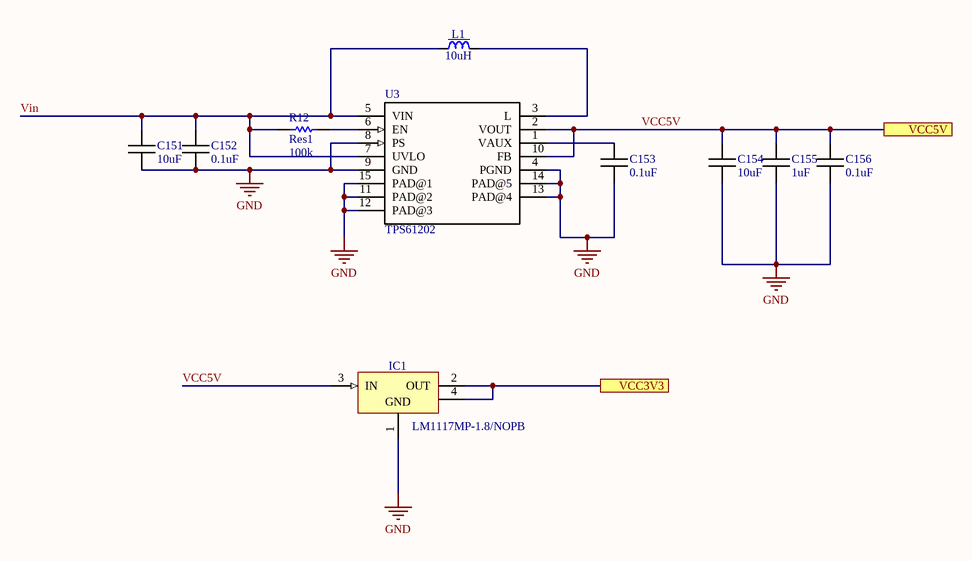
[diagram p2: Sheet3.SchDoc]

### Parts
(Parts that share a designator on the sheet are numbered #1, #2 ... from top to bottom, then left to right.)
C151  10uF  [C 0603 / 1608]
C152  0.1uF  [C 0603 / 1608]
C153  0.1uF  [C 0603 / 1608]
C154  10uF  [C 0603 / 1608]
C155  1uF  [C 0603 / 1608]
C156  0.1uF  [C 0603 / 1608]
IC1  LM1117MP-1.8/NOPB  [SOT230P700X180-4N]
L1  10uH  [IND_COILCRAFT_SD43]
R12#2  Res1  value 100k  [C 0603 / 1608]
U3#2  TPS61202  [QFN-10_PAD]

### Ports
VCC3V3, VCC5V

### Nets
GND: C151.1 C152.1 C153.1 C154.1 C155.1 C156.1 IC1.1(GND) U3#2.4(PGND) U3#2.8(PS) U3#2.9(GND) U3#2.11(PAD@2) U3#2.12(PAD@3) U3#2.13(PAD@4) U3#2.14(PAD@5) U3#2.15(PAD@1)
VCC5V: C154.2 C155.2 C156.2 IC1.3(IN) U3#2.2(VOUT) U3#2.10(FB) ; port VCC5V
Vin: C151.2 C152.2 L1.1 R12#2.1 U3#2.5(VIN) U3#2.7(UVLO)
NetC153_2: C153.2 U3#2.1(VAUX)
NetIC1_2: IC1.2(OUT) IC1.4(OUT) ; port VCC3V3
NetL1_2: L1.2 U3#2.3(L)
NetR12#2_2: R12#2.2 U3#2.6(EN)

### Library data of the parts
C151-C156 = Capacitor
IC1 = LM1117MP-1.8/NOPB: 3-Terminal Regulator 1=GND 2=OUT 3=IN 4=OUT; Part Description: 1.8V 800mA Low-Dropout Linear Regulator; Manufacturer: TEXAS INSTRUMENTS; PressFit: No; Bonding: No; Part Number: LM1117MP-1.8/NOPB; Component Kind: Standard; Component Type: Standard; Device: LM1117MP-1.8/NOPB; PackageDescription: SOT223, 2.30mm pitch; 3 pin, 3.70mm W X 6.70mm L, IPC Medium Density; Manufacturer Part Number: LM1117MP-1.8/NOPB; Pin Count: 4; Case: SOT223; Mounted: Yes; Socket: No; SMD: Yes; Sense: No; ComponentHeight: 1.8mm; HelpURL: \\cern.ch\dfs\Applications\Altium\Datasheets\LM1117MP-1.8-NOPB.pdf; Author: CERN DEM JLC; CreateDate: 18/01/2011; LatestRevisionDate: 16/09/2014
L1 = IND_10UH_20%_COILCRAFT_SD43-103MLB: Inductor With Core; Part Description: SMT Power Inductor (SD43 Series); Power: 1.3A; Resistance: 0.182R; Tolerance: ±20%; Part Number: IND_10UH_20%_COILCRAFT_SD43-103MLB; Component Kind: Standard; Component Type: Standard; Pin Count: 2; Value: 10uH; Status: None; Manufacturer: COILCRAFT; Manufacturer Part Number: SD43-103MLB; Mounted: Yes; Socket: No; SMD: Yes; Sense: No; ComponentHeight: 3.45mm; HelpURL: \\cern.ch\dfs\Applications\Altium\Datasheets\IND_COILCRAFT_SD43.pdf; Author: CERN DEM JLC; CreateDate: 05/12/2016; LatestRevisionDate: 05/12/2016
R12#2 = Res1: Resistor; Published: 8-Jun-2000; LatestRevisionDate: 17-Jul-2002; LatestRevisionNote: Re-released for DXP Platform.; PackageReference: AXIAL-0.3; Publisher: Altium Limited; PackageDescription: Axial Device, Thru-Hole; 2 Leads; 0.3 in Pin Spacing
U3#2 = TPS61200: 0.3V Input Voltage Boost Converter with 1.3A Switches and Down Mode in 3x3 QFN; MF: Texas Instruments; Package: QFN-10 Texas Instruments; Price: None; Availability: Unavailable; MP: TPS61200; SnapEDA_Link: https://www.snapeda.com/parts/TPS61200/Texas%2520Instruments/view-part/?ref=snap; Value: *

## Sheet Sheet4_Matrix.SchDoc
size A0
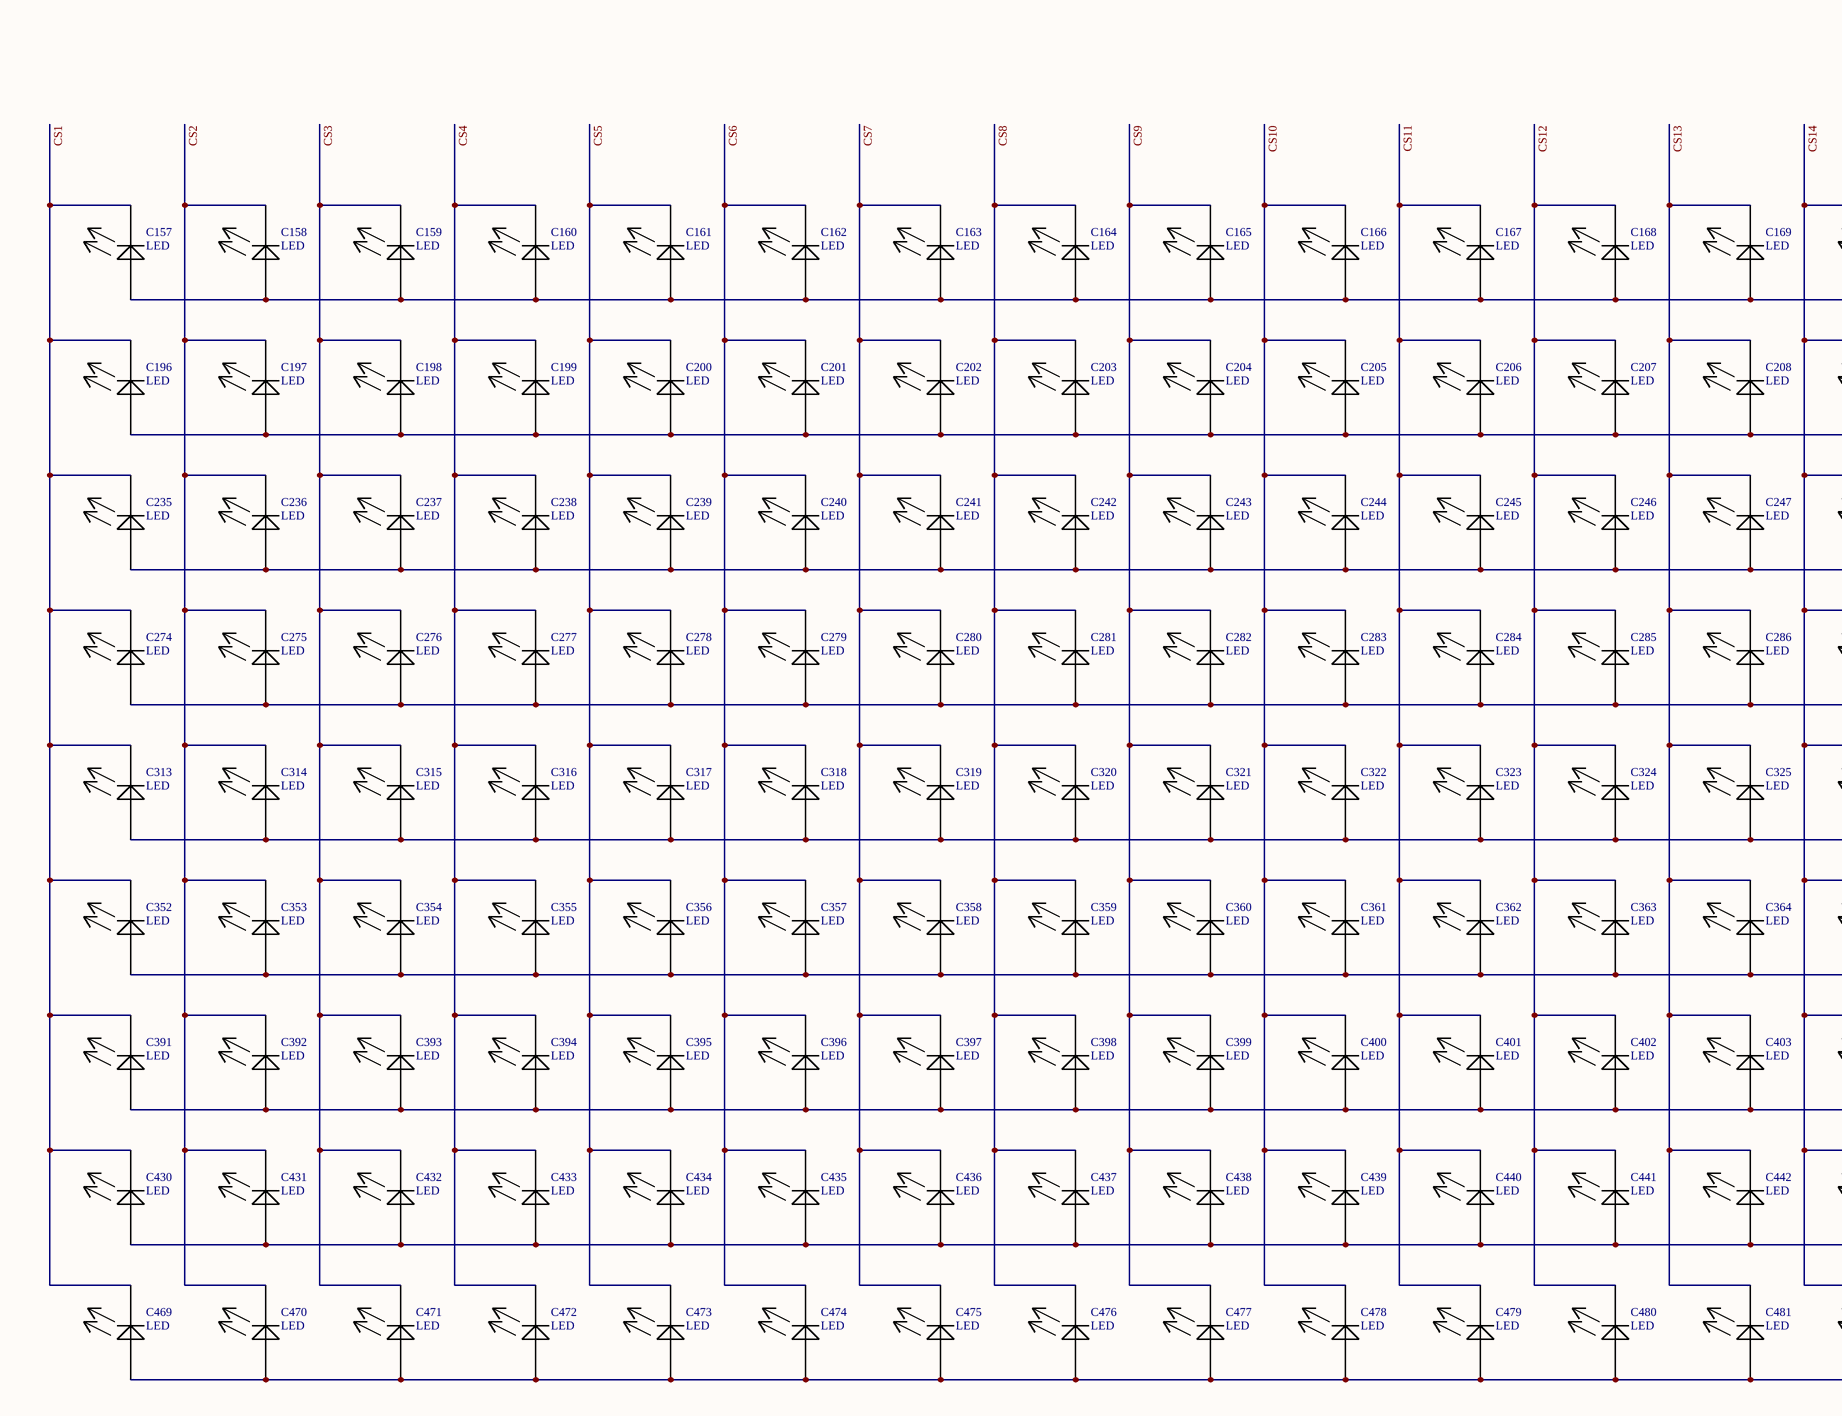
[diagram p3: Sheet4_Matrix.SchDoc, left]
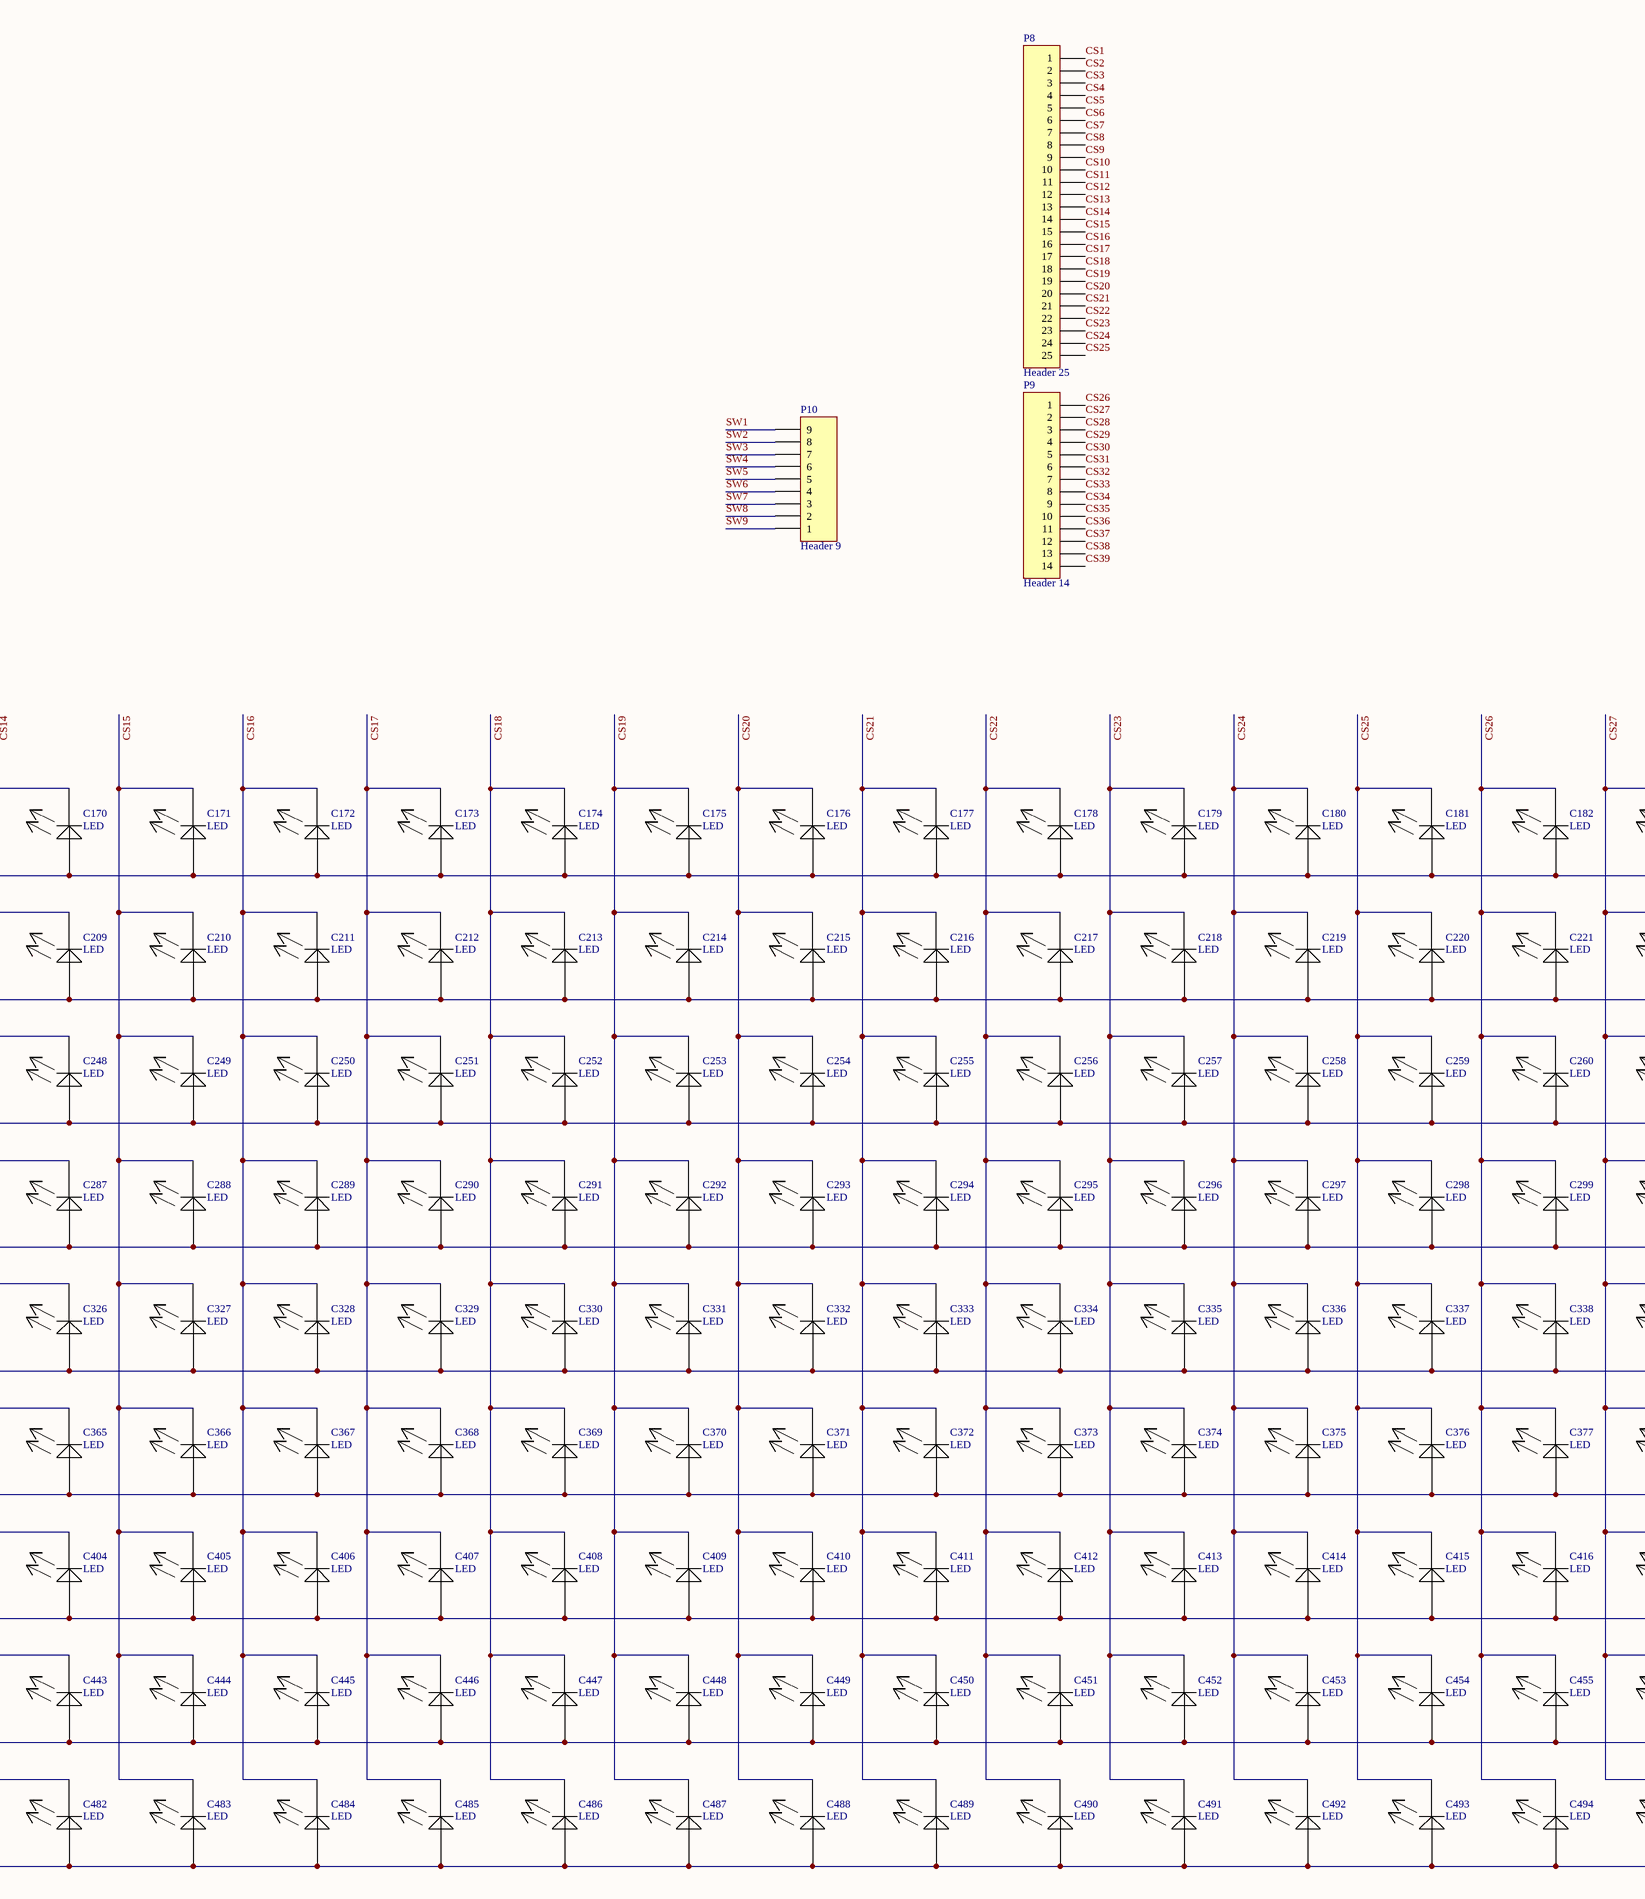
[diagram p4: Sheet4_Matrix.SchDoc, middle]
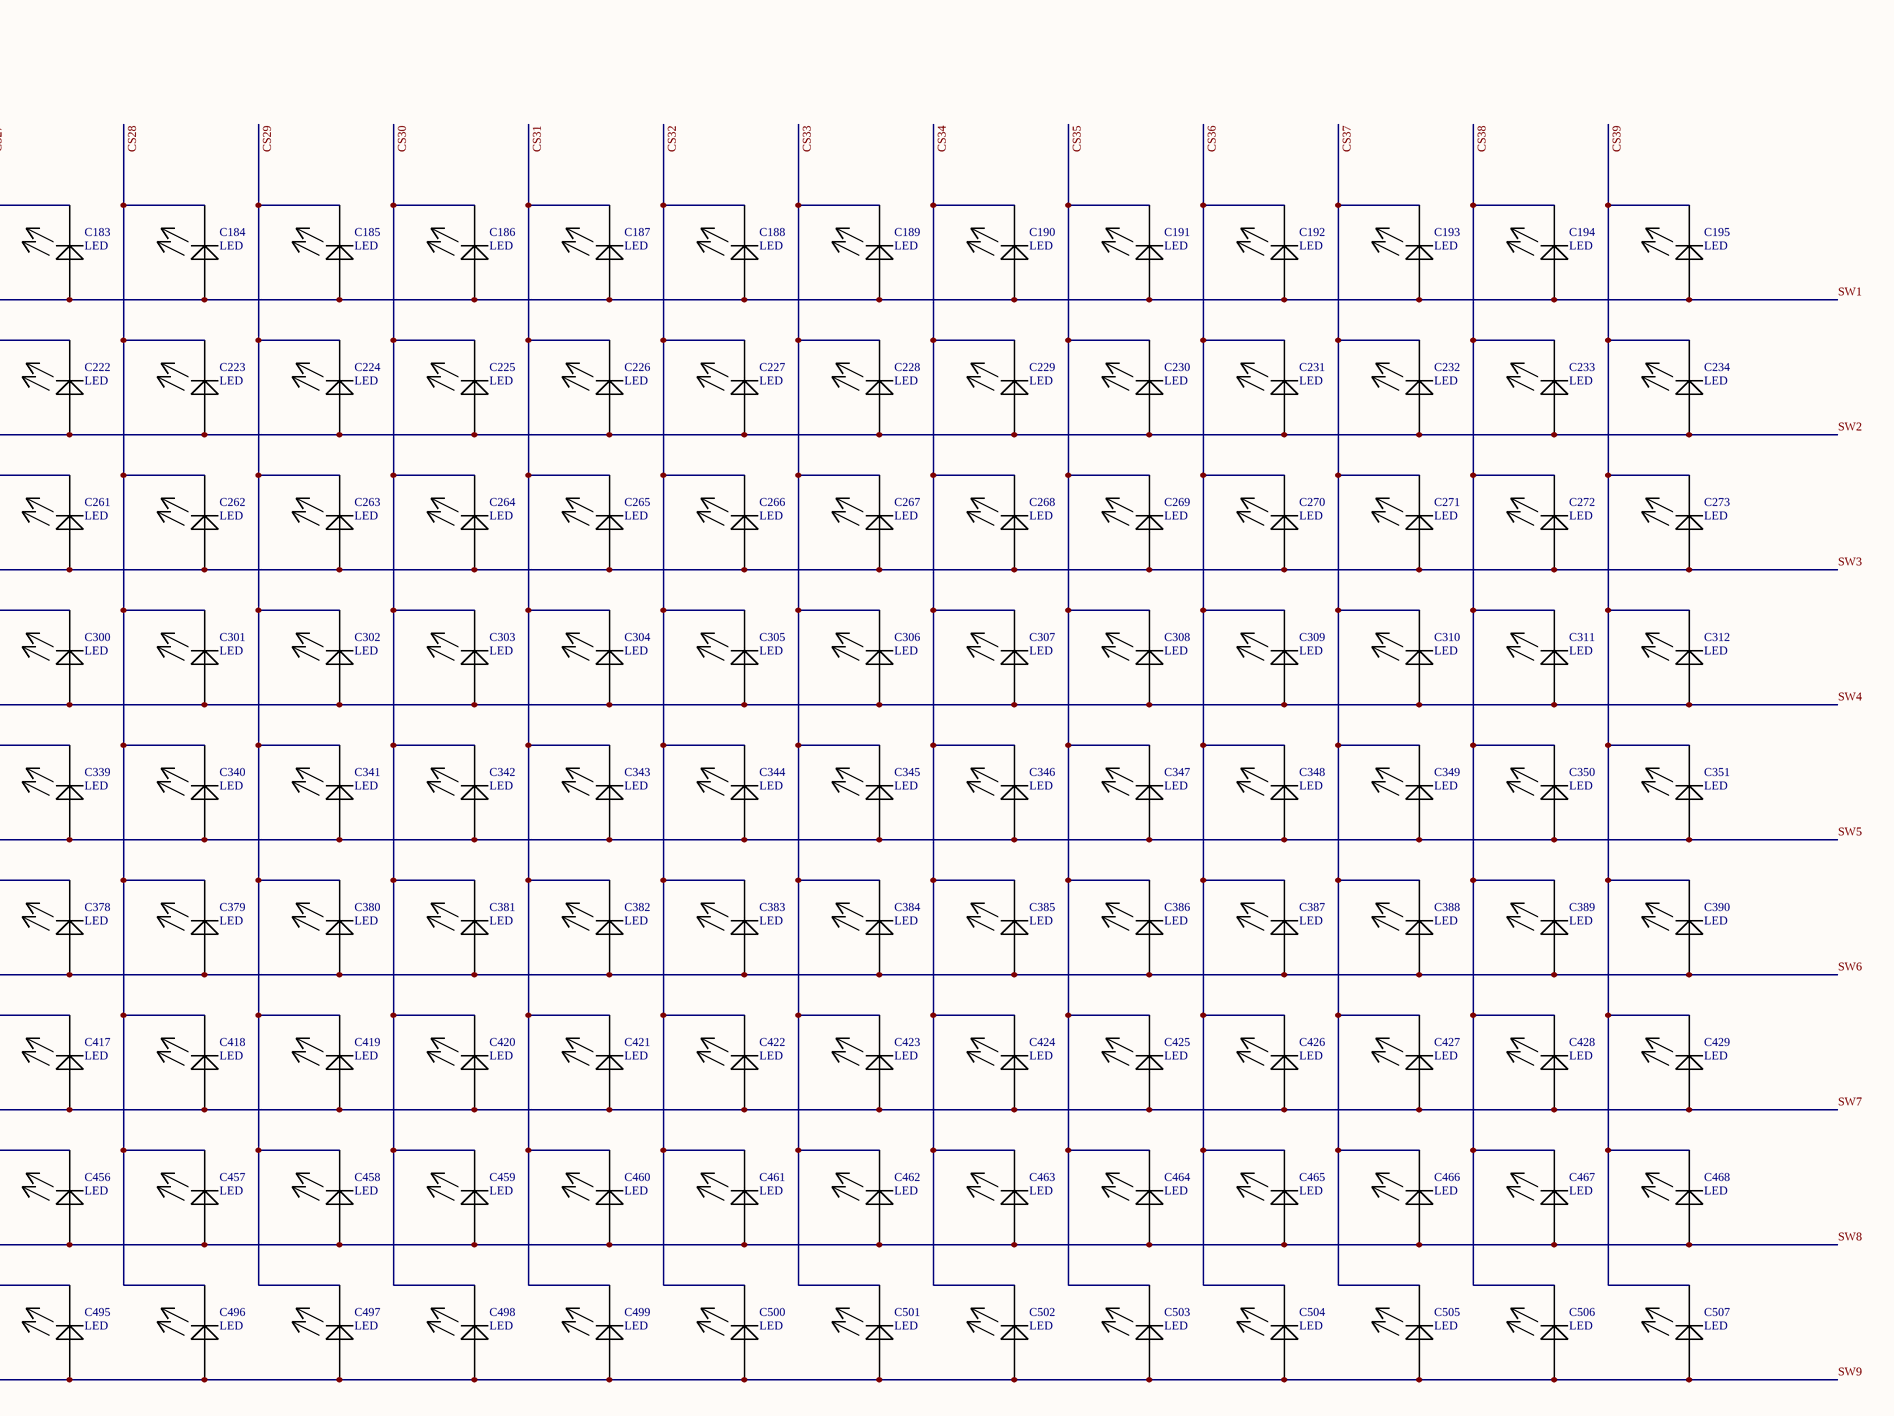
[diagram p5: Sheet4_Matrix.SchDoc, right]

### Parts
C157  LED  [LED 0603(2)]
C158  LED  [LED 0603(2)]
C159  LED  [LED 0603(2)]
C160  LED  [LED 0603(2)]
C161  LED  [LED 0603(2)]
C162  LED  [LED 0603(2)]
C163  LED  [LED 0603(2)]
C164  LED  [LED 0603(2)]
C165  LED  [LED 0603(2)]
C166  LED  [LED 0603(2)]
C167  LED  [LED 0603(2)]
C168  LED  [LED 0603(2)]
C169  LED  [LED 0603(2)]
C170  LED  [LED 0603(2)]
C171  LED  [LED 0603(2)]
C172  LED  [LED 0603(2)]
C173  LED  [LED 0603(2)]
C174  LED  [LED 0603(2)]
C175  LED  [LED 0603(2)]
C176  LED  [LED 0603(2)]
C177  LED  [LED 0603(2)]
C178  LED  [LED 0603(2)]
C179  LED  [LED 0603(2)]
C180  LED  [LED 0603(2)]
C181  LED  [LED 0603(2)]
C182  LED  [LED 0603(2)]
C183  LED  [LED 0603(2)]
C184  LED  [LED 0603(2)]
C185  LED  [LED 0603(2)]
C186  LED  [LED 0603(2)]
C187  LED  [LED 0603(2)]
C188  LED  [LED 0603(2)]
C189  LED  [LED 0603(2)]
C190  LED  [LED 0603(2)]
C191  LED  [LED 0603(2)]
C192  LED  [LED 0603(2)]
C193  LED  [LED 0603(2)]
C194  LED  [LED 0603(2)]
C195  LED  [LED 0603(2)]
C196  LED  [LED 0603(2)]
C197  LED  [LED 0603(2)]
C198  LED  [LED 0603(2)]
C199  LED  [LED 0603(2)]
C200  LED  [LED 0603(2)]
C201  LED  [LED 0603(2)]
C202  LED  [LED 0603(2)]
C203  LED  [LED 0603(2)]
C204  LED  [LED 0603(2)]
C205  LED  [LED 0603(2)]
C206  LED  [LED 0603(2)]
C207  LED  [LED 0603(2)]
C208  LED  [LED 0603(2)]
C209  LED  [LED 0603(2)]
C210  LED  [LED 0603(2)]
C211  LED  [LED 0603(2)]
C212  LED  [LED 0603(2)]
C213  LED  [LED 0603(2)]
C214  LED  [LED 0603(2)]
C215  LED  [LED 0603(2)]
C216  LED  [LED 0603(2)]
C217  LED  [LED 0603(2)]
C218  LED  [LED 0603(2)]
C219  LED  [LED 0603(2)]
C220  LED  [LED 0603(2)]
C221  LED  [LED 0603(2)]
C222  LED  [LED 0603(2)]
C223  LED  [LED 0603(2)]
C224  LED  [LED 0603(2)]
C225  LED  [LED 0603(2)]
C226  LED  [LED 0603(2)]
C227  LED  [LED 0603(2)]
C228  LED  [LED 0603(2)]
C229  LED  [LED 0603(2)]
C230  LED  [LED 0603(2)]
C231  LED  [LED 0603(2)]
C232  LED  [LED 0603(2)]
C233  LED  [LED 0603(2)]
C234  LED  [LED 0603(2)]
C235  LED  [LED 0603(2)]
C236  LED  [LED 0603(2)]
C237  LED  [LED 0603(2)]
C238  LED  [LED 0603(2)]
C239  LED  [LED 0603(2)]
C240  LED  [LED 0603(2)]
C241  LED  [LED 0603(2)]
C242  LED  [LED 0603(2)]
C243  LED  [LED 0603(2)]
C244  LED  [LED 0603(2)]
C245  LED  [LED 0603(2)]
C246  LED  [LED 0603(2)]
C247  LED  [LED 0603(2)]
C248  LED  [LED 0603(2)]
C249  LED  [LED 0603(2)]
C250  LED  [LED 0603(2)]
C251  LED  [LED 0603(2)]
C252  LED  [LED 0603(2)]
C253  LED  [LED 0603(2)]
C254  LED  [LED 0603(2)]
C255  LED  [LED 0603(2)]
C256  LED  [LED 0603(2)]
C257  LED  [LED 0603(2)]
C258  LED  [LED 0603(2)]
C259  LED  [LED 0603(2)]
C260  LED  [LED 0603(2)]
C261  LED  [LED 0603(2)]
C262  LED  [LED 0603(2)]
C263  LED  [LED 0603(2)]
C264  LED  [LED 0603(2)]
C265  LED  [LED 0603(2)]
C266  LED  [LED 0603(2)]
C267  LED  [LED 0603(2)]
C268  LED  [LED 0603(2)]
C269  LED  [LED 0603(2)]
C270  LED  [LED 0603(2)]
C271  LED  [LED 0603(2)]
C272  LED  [LED 0603(2)]
C273  LED  [LED 0603(2)]
C274  LED  [LED 0603(2)]
C275  LED  [LED 0603(2)]
C276  LED  [LED 0603(2)]
C277  LED  [LED 0603(2)]
C278  LED  [LED 0603(2)]
C279  LED  [LED 0603(2)]
C280  LED  [LED 0603(2)]
C281  LED  [LED 0603(2)]
C282  LED  [LED 0603(2)]
C283  LED  [LED 0603(2)]
C284  LED  [LED 0603(2)]
C285  LED  [LED 0603(2)]
C286  LED  [LED 0603(2)]
C287  LED  [LED 0603(2)]
C288  LED  [LED 0603(2)]
C289  LED  [LED 0603(2)]
C290  LED  [LED 0603(2)]
C291  LED  [LED 0603(2)]
C292  LED  [LED 0603(2)]
C293  LED  [LED 0603(2)]
C294  LED  [LED 0603(2)]
C295  LED  [LED 0603(2)]
C296  LED  [LED 0603(2)]
C297  LED  [LED 0603(2)]
C298  LED  [LED 0603(2)]
C299  LED  [LED 0603(2)]
C300  LED  [LED 0603(2)]
C301  LED  [LED 0603(2)]
C302  LED  [LED 0603(2)]
C303  LED  [LED 0603(2)]
C304  LED  [LED 0603(2)]
C305  LED  [LED 0603(2)]
C306  LED  [LED 0603(2)]
C307  LED  [LED 0603(2)]
C308  LED  [LED 0603(2)]
C309  LED  [LED 0603(2)]
C310  LED  [LED 0603(2)]
C311  LED  [LED 0603(2)]
C312  LED  [LED 0603(2)]
C313  LED  [LED 0603(2)]
C314  LED  [LED 0603(2)]
C315  LED  [LED 0603(2)]
C316  LED  [LED 0603(2)]
C317  LED  [LED 0603(2)]
C318  LED  [LED 0603(2)]
C319  LED  [LED 0603(2)]
C320  LED  [LED 0603(2)]
C321  LED  [LED 0603(2)]
C322  LED  [LED 0603(2)]
C323  LED  [LED 0603(2)]
C324  LED  [LED 0603(2)]
C325  LED  [LED 0603(2)]
C326  LED  [LED 0603(2)]
C327  LED  [LED 0603(2)]
C328  LED  [LED 0603(2)]
C329  LED  [LED 0603(2)]
C330  LED  [LED 0603(2)]
C331  LED  [LED 0603(2)]
C332  LED  [LED 0603(2)]
C333  LED  [LED 0603(2)]
C334  LED  [LED 0603(2)]
C335  LED  [LED 0603(2)]
C336  LED  [LED 0603(2)]
C337  LED  [LED 0603(2)]
C338  LED  [LED 0603(2)]
C339  LED  [LED 0603(2)]
C340  LED  [LED 0603(2)]
C341  LED  [LED 0603(2)]
C342  LED  [LED 0603(2)]
C343  LED  [LED 0603(2)]
C344  LED  [LED 0603(2)]
C345  LED  [LED 0603(2)]
C346  LED  [LED 0603(2)]
C347  LED  [LED 0603(2)]
C348  LED  [LED 0603(2)]
C349  LED  [LED 0603(2)]
C350  LED  [LED 0603(2)]
C351  LED  [LED 0603(2)]
C352  LED  [LED 0603(2)]
C353  LED  [LED 0603(2)]
C354  LED  [LED 0603(2)]
C355  LED  [LED 0603(2)]
C356  LED  [LED 0603(2)]
C357  LED  [LED 0603(2)]
C358  LED  [LED 0603(2)]
C359  LED  [LED 0603(2)]
C360  LED  [LED 0603(2)]
C361  LED  [LED 0603(2)]
C362  LED  [LED 0603(2)]
C363  LED  [LED 0603(2)]
C364  LED  [LED 0603(2)]
C365  LED  [LED 0603(2)]
C366  LED  [LED 0603(2)]
C367  LED  [LED 0603(2)]
C368  LED  [LED 0603(2)]
C369  LED  [LED 0603(2)]
C370  LED  [LED 0603(2)]
C371  LED  [LED 0603(2)]
C372  LED  [LED 0603(2)]
C373  LED  [LED 0603(2)]
C374  LED  [LED 0603(2)]
C375  LED  [LED 0603(2)]
C376  LED  [LED 0603(2)]
C377  LED  [LED 0603(2)]
C378  LED  [LED 0603(2)]
C379  LED  [LED 0603(2)]
C380  LED  [LED 0603(2)]
C381  LED  [LED 0603(2)]
C382  LED  [LED 0603(2)]
C383  LED  [LED 0603(2)]
C384  LED  [LED 0603(2)]
C385  LED  [LED 0603(2)]
C386  LED  [LED 0603(2)]
C387  LED  [LED 0603(2)]
C388  LED  [LED 0603(2)]
C389  LED  [LED 0603(2)]
C390  LED  [LED 0603(2)]
C391  LED  [LED 0603(2)]
C392  LED  [LED 0603(2)]
C393  LED  [LED 0603(2)]
C394  LED  [LED 0603(2)]
C395  LED  [LED 0603(2)]
C396  LED  [LED 0603(2)]
C397  LED  [LED 0603(2)]
C398  LED  [LED 0603(2)]
C399  LED  [LED 0603(2)]
C400  LED  [LED 0603(2)]
C401  LED  [LED 0603(2)]
C402  LED  [LED 0603(2)]
C403  LED  [LED 0603(2)]
C404  LED  [LED 0603(2)]
C405  LED  [LED 0603(2)]
C406  LED  [LED 0603(2)]
C407  LED  [LED 0603(2)]
C408  LED  [LED 0603(2)]
C409  LED  [LED 0603(2)]
C410  LED  [LED 0603(2)]
C411  LED  [LED 0603(2)]
C412  LED  [LED 0603(2)]
C413  LED  [LED 0603(2)]
C414  LED  [LED 0603(2)]
C415  LED  [LED 0603(2)]
C416  LED  [LED 0603(2)]
C417  LED  [LED 0603(2)]
C418  LED  [LED 0603(2)]
C419  LED  [LED 0603(2)]
C420  LED  [LED 0603(2)]
C421  LED  [LED 0603(2)]
C422  LED  [LED 0603(2)]
C423  LED  [LED 0603(2)]
C424  LED  [LED 0603(2)]
C425  LED  [LED 0603(2)]
C426  LED  [LED 0603(2)]
C427  LED  [LED 0603(2)]
C428  LED  [LED 0603(2)]
C429  LED  [LED 0603(2)]
C430  LED  [LED 0603(2)]
C431  LED  [LED 0603(2)]
C432  LED  [LED 0603(2)]
C433  LED  [LED 0603(2)]
C434  LED  [LED 0603(2)]
C435  LED  [LED 0603(2)]
C436  LED  [LED 0603(2)]
C437  LED  [LED 0603(2)]
C438  LED  [LED 0603(2)]
C439  LED  [LED 0603(2)]
C440  LED  [LED 0603(2)]
C441  LED  [LED 0603(2)]
C442  LED  [LED 0603(2)]
C443  LED  [LED 0603(2)]
C444  LED  [LED 0603(2)]
C445  LED  [LED 0603(2)]
C446  LED  [LED 0603(2)]
C447  LED  [LED 0603(2)]
C448  LED  [LED 0603(2)]
C449  LED  [LED 0603(2)]
C450  LED  [LED 0603(2)]
C451  LED  [LED 0603(2)]
C452  LED  [LED 0603(2)]
C453  LED  [LED 0603(2)]
C454  LED  [LED 0603(2)]
C455  LED  [LED 0603(2)]
C456  LED  [LED 0603(2)]
C457  LED  [LED 0603(2)]
C458  LED  [LED 0603(2)]
C459  LED  [LED 0603(2)]
C460  LED  [LED 0603(2)]
C461  LED  [LED 0603(2)]
C462  LED  [LED 0603(2)]
C463  LED  [LED 0603(2)]
C464  LED  [LED 0603(2)]
C465  LED  [LED 0603(2)]
C466  LED  [LED 0603(2)]
C467  LED  [LED 0603(2)]
C468  LED  [LED 0603(2)]
C469  LED  [LED 0603(2)]
C470  LED  [LED 0603(2)]
C471  LED  [LED 0603(2)]
C472  LED  [LED 0603(2)]
C473  LED  [LED 0603(2)]
C474  LED  [LED 0603(2)]
C475  LED  [LED 0603(2)]
C476  LED  [LED 0603(2)]
C477  LED  [LED 0603(2)]
C478  LED  [LED 0603(2)]
C479  LED  [LED 0603(2)]
C480  LED  [LED 0603(2)]
C481  LED  [LED 0603(2)]
C482  LED  [LED 0603(2)]
C483  LED  [LED 0603(2)]
C484  LED  [LED 0603(2)]
C485  LED  [LED 0603(2)]
C486  LED  [LED 0603(2)]
C487  LED  [LED 0603(2)]
C488  LED  [LED 0603(2)]
C489  LED  [LED 0603(2)]
C490  LED  [LED 0603(2)]
C491  LED  [LED 0603(2)]
C492  LED  [LED 0603(2)]
C493  LED  [LED 0603(2)]
C494  LED  [LED 0603(2)]
C495  LED  [LED 0603(2)]
C496  LED  [LED 0603(2)]
C497  LED  [LED 0603(2)]
C498  LED  [LED 0603(2)]
C499  LED  [LED 0603(2)]
C500  LED  [LED 0603(2)]
C501  LED  [LED 0603(2)]
C502  LED  [LED 0603(2)]
C503  LED  [LED 0603(2)]
C504  LED  [LED 0603(2)]
C505  LED  [LED 0603(2)]
C506  LED  [LED 0603(2)]
C507  LED  [LED 0603(2)]
P8  Header 25  [HDR1X25]
P9  Header 14  [HDR1X14]
P10  Header 9  [HDR1X9]

### Nets
CS1: C157.2(-) C196.2(-) C235.2(-) C274.2(-) C313.2(-) C352.2(-) C391.2(-) C430.2(-) C469.2(-) P8.1
CS2: C158.2(-) C197.2(-) C236.2(-) C275.2(-) C314.2(-) C353.2(-) C392.2(-) C431.2(-) C470.2(-) P8.2
CS3: C159.2(-) C198.2(-) C237.2(-) C276.2(-) C315.2(-) C354.2(-) C393.2(-) C432.2(-) C471.2(-) P8.3
CS4: C160.2(-) C199.2(-) C238.2(-) C277.2(-) C316.2(-) C355.2(-) C394.2(-) C433.2(-) C472.2(-) P8.4
CS5: C161.2(-) C200.2(-) C239.2(-) C278.2(-) C317.2(-) C356.2(-) C395.2(-) C434.2(-) C473.2(-) P8.5
CS6: C162.2(-) C201.2(-) C240.2(-) C279.2(-) C318.2(-) C357.2(-) C396.2(-) C435.2(-) C474.2(-) P8.6
CS7: C163.2(-) C202.2(-) C241.2(-) C280.2(-) C319.2(-) C358.2(-) C397.2(-) C436.2(-) C475.2(-) P8.7
CS8: C164.2(-) C203.2(-) C242.2(-) C281.2(-) C320.2(-) C359.2(-) C398.2(-) C437.2(-) C476.2(-) P8.8
CS9: C165.2(-) C204.2(-) C243.2(-) C282.2(-) C321.2(-) C360.2(-) C399.2(-) C438.2(-) C477.2(-) P8.9
CS10: C166.2(-) C205.2(-) C244.2(-) C283.2(-) C322.2(-) C361.2(-) C400.2(-) C439.2(-) C478.2(-) P8.10
CS11: C167.2(-) C206.2(-) C245.2(-) C284.2(-) C323.2(-) C362.2(-) C401.2(-) C440.2(-) C479.2(-) P8.11
CS12: C168.2(-) C207.2(-) C246.2(-) C285.2(-) C324.2(-) C363.2(-) C402.2(-) C441.2(-) C480.2(-) P8.12
CS13: C169.2(-) C208.2(-) C247.2(-) C286.2(-) C325.2(-) C364.2(-) C403.2(-) C442.2(-) C481.2(-) P8.13
CS14: C170.2(-) C209.2(-) C248.2(-) C287.2(-) C326.2(-) C365.2(-) C404.2(-) C443.2(-) C482.2(-) P8.14
CS15: C171.2(-) C210.2(-) C249.2(-) C288.2(-) C327.2(-) C366.2(-) C405.2(-) C444.2(-) C483.2(-) P8.15
CS16: C172.2(-) C211.2(-) C250.2(-) C289.2(-) C328.2(-) C367.2(-) C406.2(-) C445.2(-) C484.2(-) P8.16
CS17: C173.2(-) C212.2(-) C251.2(-) C290.2(-) C329.2(-) C368.2(-) C407.2(-) C446.2(-) C485.2(-) P8.17
CS18: C174.2(-) C213.2(-) C252.2(-) C291.2(-) C330.2(-) C369.2(-) C408.2(-) C447.2(-) C486.2(-) P8.18
CS19: C175.2(-) C214.2(-) C253.2(-) C292.2(-) C331.2(-) C370.2(-) C409.2(-) C448.2(-) C487.2(-) P8.19
CS20: C176.2(-) C215.2(-) C254.2(-) C293.2(-) C332.2(-) C371.2(-) C410.2(-) C449.2(-) C488.2(-) P8.20
CS21: C177.2(-) C216.2(-) C255.2(-) C294.2(-) C333.2(-) C372.2(-) C411.2(-) C450.2(-) C489.2(-) P8.21
CS22: C178.2(-) C217.2(-) C256.2(-) C295.2(-) C334.2(-) C373.2(-) C412.2(-) C451.2(-) C490.2(-) P8.22
CS23: C179.2(-) C218.2(-) C257.2(-) C296.2(-) C335.2(-) C374.2(-) C413.2(-) C452.2(-) C491.2(-) P8.23
CS24: C180.2(-) C219.2(-) C258.2(-) C297.2(-) C336.2(-) C375.2(-) C414.2(-) C453.2(-) C492.2(-) P8.24
CS25: C181.2(-) C220.2(-) C259.2(-) C298.2(-) C337.2(-) C376.2(-) C415.2(-) C454.2(-) C493.2(-) P8.25
CS26: C182.2(-) C221.2(-) C260.2(-) C299.2(-) C338.2(-) C377.2(-) C416.2(-) C455.2(-) C494.2(-) P9.1
CS27: C183.2(-) C222.2(-) C261.2(-) C300.2(-) C339.2(-) C378.2(-) C417.2(-) C456.2(-) C495.2(-) P9.2
CS28: C184.2(-) C223.2(-) C262.2(-) C301.2(-) C340.2(-) C379.2(-) C418.2(-) C457.2(-) C496.2(-) P9.3
CS29: C185.2(-) C224.2(-) C263.2(-) C302.2(-) C341.2(-) C380.2(-) C419.2(-) C458.2(-) C497.2(-) P9.4
CS30: C186.2(-) C225.2(-) C264.2(-) C303.2(-) C342.2(-) C381.2(-) C420.2(-) C459.2(-) C498.2(-) P9.5
CS31: C187.2(-) C226.2(-) C265.2(-) C304.2(-) C343.2(-) C382.2(-) C421.2(-) C460.2(-) C499.2(-) P9.6
CS32: C188.2(-) C227.2(-) C266.2(-) C305.2(-) C344.2(-) C383.2(-) C422.2(-) C461.2(-) C500.2(-) P9.7
CS33: C189.2(-) C228.2(-) C267.2(-) C306.2(-) C345.2(-) C384.2(-) C423.2(-) C462.2(-) C501.2(-) P9.8
CS34: C190.2(-) C229.2(-) C268.2(-) C307.2(-) C346.2(-) C385.2(-) C424.2(-) C463.2(-) C502.2(-) P9.9
CS35: C191.2(-) C230.2(-) C269.2(-) C308.2(-) C347.2(-) C386.2(-) C425.2(-) C464.2(-) C503.2(-) P9.10
CS36: C192.2(-) C231.2(-) C270.2(-) C309.2(-) C348.2(-) C387.2(-) C426.2(-) C465.2(-) C504.2(-) P9.11
CS37: C193.2(-) C232.2(-) C271.2(-) C310.2(-) C349.2(-) C388.2(-) C427.2(-) C466.2(-) C505.2(-) P9.12
CS38: C194.2(-) C233.2(-) C272.2(-) C311.2(-) C350.2(-) C389.2(-) C428.2(-) C467.2(-) C506.2(-) P9.13
CS39: C195.2(-) C234.2(-) C273.2(-) C312.2(-) C351.2(-) C390.2(-) C429.2(-) C468.2(-) C507.2(-) P9.14
SW1: C157.1(+) C158.1(+) C159.1(+) C160.1(+) C161.1(+) C162.1(+) C163.1(+) C164.1(+) C165.1(+) C166.1(+) C167.1(+) C168.1(+) C169.1(+) C170.1(+) C171.1(+) C172.1(+) C173.1(+) C174.1(+) C175.1(+) C176.1(+) C177.1(+) C178.1(+) C179.1(+) C180.1(+) C181.1(+) C182.1(+) C183.1(+) C184.1(+) C185.1(+) C186.1(+) C187.1(+) C188.1(+) C189.1(+) C190.1(+) C191.1(+) C192.1(+) C193.1(+) C194.1(+) C195.1(+) P10.9
SW2: C196.1(+) C197.1(+) C198.1(+) C199.1(+) C200.1(+) C201.1(+) C202.1(+) C203.1(+) C204.1(+) C205.1(+) C206.1(+) C207.1(+) C208.1(+) C209.1(+) C210.1(+) C211.1(+) C212.1(+) C213.1(+) C214.1(+) C215.1(+) C216.1(+) C217.1(+) C218.1(+) C219.1(+) C220.1(+) C221.1(+) C222.1(+) C223.1(+) C224.1(+) C225.1(+) C226.1(+) C227.1(+) C228.1(+) C229.1(+) C230.1(+) C231.1(+) C232.1(+) C233.1(+) C234.1(+) P10.8
SW3: C235.1(+) C236.1(+) C237.1(+) C238.1(+) C239.1(+) C240.1(+) C241.1(+) C242.1(+) C243.1(+) C244.1(+) C245.1(+) C246.1(+) C247.1(+) C248.1(+) C249.1(+) C250.1(+) C251.1(+) C252.1(+) C253.1(+) C254.1(+) C255.1(+) C256.1(+) C257.1(+) C258.1(+) C259.1(+) C260.1(+) C261.1(+) C262.1(+) C263.1(+) C264.1(+) C265.1(+) C266.1(+) C267.1(+) C268.1(+) C269.1(+) C270.1(+) C271.1(+) C272.1(+) C273.1(+) P10.7
SW4: C274.1(+) C275.1(+) C276.1(+) C277.1(+) C278.1(+) C279.1(+) C280.1(+) C281.1(+) C282.1(+) C283.1(+) C284.1(+) C285.1(+) C286.1(+) C287.1(+) C288.1(+) C289.1(+) C290.1(+) C291.1(+) C292.1(+) C293.1(+) C294.1(+) C295.1(+) C296.1(+) C297.1(+) C298.1(+) C299.1(+) C300.1(+) C301.1(+) C302.1(+) C303.1(+) C304.1(+) C305.1(+) C306.1(+) C307.1(+) C308.1(+) C309.1(+) C310.1(+) C311.1(+) C312.1(+) P10.6
SW5: C313.1(+) C314.1(+) C315.1(+) C316.1(+) C317.1(+) C318.1(+) C319.1(+) C320.1(+) C321.1(+) C322.1(+) C323.1(+) C324.1(+) C325.1(+) C326.1(+) C327.1(+) C328.1(+) C329.1(+) C330.1(+) C331.1(+) C332.1(+) C333.1(+) C334.1(+) C335.1(+) C336.1(+) C337.1(+) C338.1(+) C339.1(+) C340.1(+) C341.1(+) C342.1(+) C343.1(+) C344.1(+) C345.1(+) C346.1(+) C347.1(+) C348.1(+) C349.1(+) C350.1(+) C351.1(+) P10.5
SW6: C352.1(+) C353.1(+) C354.1(+) C355.1(+) C356.1(+) C357.1(+) C358.1(+) C359.1(+) C360.1(+) C361.1(+) C362.1(+) C363.1(+) C364.1(+) C365.1(+) C366.1(+) C367.1(+) C368.1(+) C369.1(+) C370.1(+) C371.1(+) C372.1(+) C373.1(+) C374.1(+) C375.1(+) C376.1(+) C377.1(+) C378.1(+) C379.1(+) C380.1(+) C381.1(+) C382.1(+) C383.1(+) C384.1(+) C385.1(+) C386.1(+) C387.1(+) C388.1(+) C389.1(+) C390.1(+) P10.4
SW7: C391.1(+) C392.1(+) C393.1(+) C394.1(+) C395.1(+) C396.1(+) C397.1(+) C398.1(+) C399.1(+) C400.1(+) C401.1(+) C402.1(+) C403.1(+) C404.1(+) C405.1(+) C406.1(+) C407.1(+) C408.1(+) C409.1(+) C410.1(+) C411.1(+) C412.1(+) C413.1(+) C414.1(+) C415.1(+) C416.1(+) C417.1(+) C418.1(+) C419.1(+) C420.1(+) C421.1(+) C422.1(+) C423.1(+) C424.1(+) C425.1(+) C426.1(+) C427.1(+) C428.1(+) C429.1(+) P10.3
SW8: C430.1(+) C431.1(+) C432.1(+) C433.1(+) C434.1(+) C435.1(+) C436.1(+) C437.1(+) C438.1(+) C439.1(+) C440.1(+) C441.1(+) C442.1(+) C443.1(+) C444.1(+) C445.1(+) C446.1(+) C447.1(+) C448.1(+) C449.1(+) C450.1(+) C451.1(+) C452.1(+) C453.1(+) C454.1(+) C455.1(+) C456.1(+) C457.1(+) C458.1(+) C459.1(+) C460.1(+) C461.1(+) C462.1(+) C463.1(+) C464.1(+) C465.1(+) C466.1(+) C467.1(+) C468.1(+) P10.2
SW9: C469.1(+) C470.1(+) C471.1(+) C472.1(+) C473.1(+) C474.1(+) C475.1(+) C476.1(+) C477.1(+) C478.1(+) C479.1(+) C480.1(+) C481.1(+) C482.1(+) C483.1(+) C484.1(+) C485.1(+) C486.1(+) C487.1(+) C488.1(+) C489.1(+) C490.1(+) C491.1(+) C492.1(+) C493.1(+) C494.1(+) C495.1(+) C496.1(+) C497.1(+) C498.1(+) C499.1(+) C500.1(+) C501.1(+) C502.1(+) C503.1(+) C504.1(+) C505.1(+) C506.1(+) C507.1(+) P10.1

### Library data of the parts
P8 = Header 25: Header, 25-Pin; LatestRevisionDate: 17-Jul-2002; LatestRevisionNote: Re-released for DXP Platform.; Publisher: Altium Limited
P9 = Header 14: Header, 14-Pin; LatestRevisionDate: 17-Jul-2002; LatestRevisionNote: Re-released for DXP Platform.; Publisher: Altium Limited
P10 = Header 9: Header, 9-Pin; LatestRevisionDate: 17-Jul-2002; LatestRevisionNote: Re-released for DXP Platform.; Publisher: Altium Limited

## Nets that join several sheets
GND: Sheet2 (63 pins), Sheet3 (15 pins)